# Altium project Rear_Controller.PrjPcb (part 1 of 2)
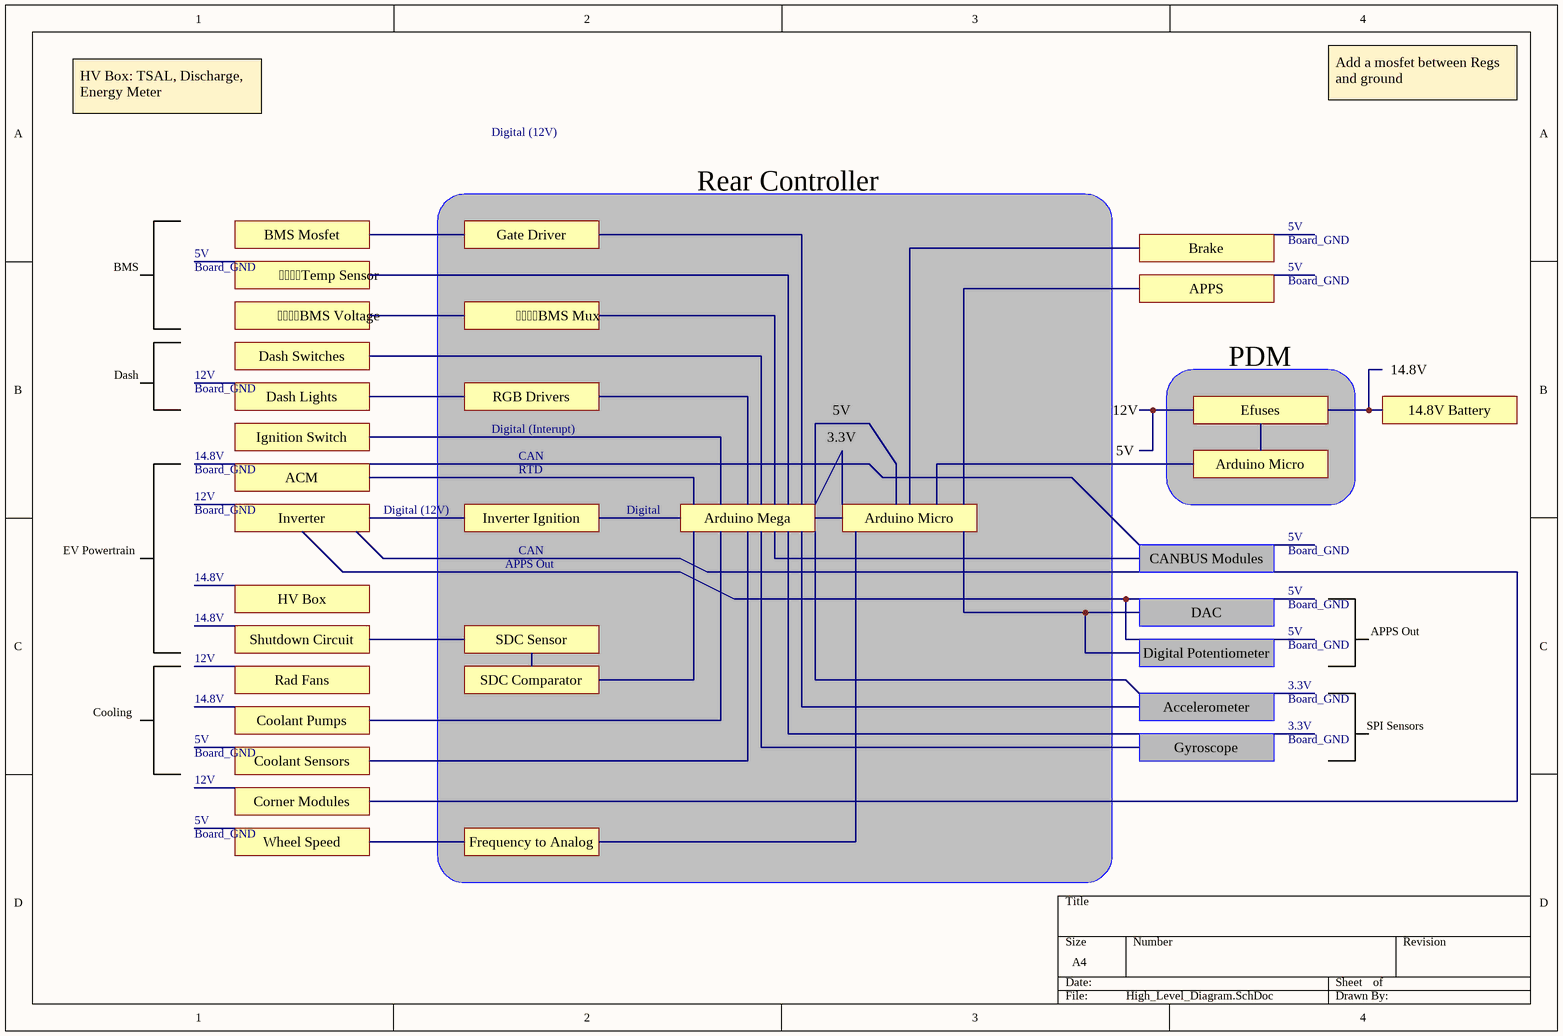
[diagram p0: High_Level_Diagram.SchDoc]
11 sheets, 140 parts. Net scope: flat (ports and power ports of the same name join across sheets).
Board file: Rear_Controller.PcbDoc
Sheets:
  High_Level_Diagram.SchDoc
  Arduino_Shields.SchDoc
  Passive_Circuits.SchDoc
  Frequency_Analog.SchDoc
  SPI_Breakout.SchDoc
  Connector.SchDoc
  PWM_Pump_Led.SchDoc
  Power_Relay.SchDoc
  Shutdown_Circuit.SchDoc
  Power_Distribution.SchDoc
  BMS.SchDoc

## Sheet High_Level_Diagram.SchDoc
size A4; SheetNumber: 1; SheetTotal: 11

### Notes on the sheet
- HV Box: TSAL, Discharge, Energy Meter
- Add a mosfet between Regs and ground
- Digital (12V)
- Rear Controller
- BMS Mosfet
- Gate Driver
- Brake
- 5V
- Board_GND
- BMS
- BMS Voltage
- Temp Sensor
- BMS Mux
- APPS
- Dash
- 12V
- Dash Switches
- PDM
- 14.8V
- Ignition Switch
- Dash Lights
- Digital (Interupt)
- RGB Drivers
- 3.3V
- Efuses
- 14.8V Battery
- Inverter
- ACM
- RTD
- CAN
- Inverter Ignition
- Digital
- Arduino Mega
- Arduino Micro
- EV Powertrain
- APPS Out
- CANBUS Modules
- Shutdown Circuit
- HV Box
- SDC Sensor
- Digital Potentiometer
- DAC
- Cooling
- Coolant Pumps
- Rad Fans
- SDC Comparator
- Accelerometer
- Coolant Sensors
- Gyroscope
- SPI Sensors
- Corner Modules
- Wheel Speed
- Frequency to Analog

## Sheet Arduino_Shields.SchDoc
size A4; SheetNumber: 2; SheetTotal: 11
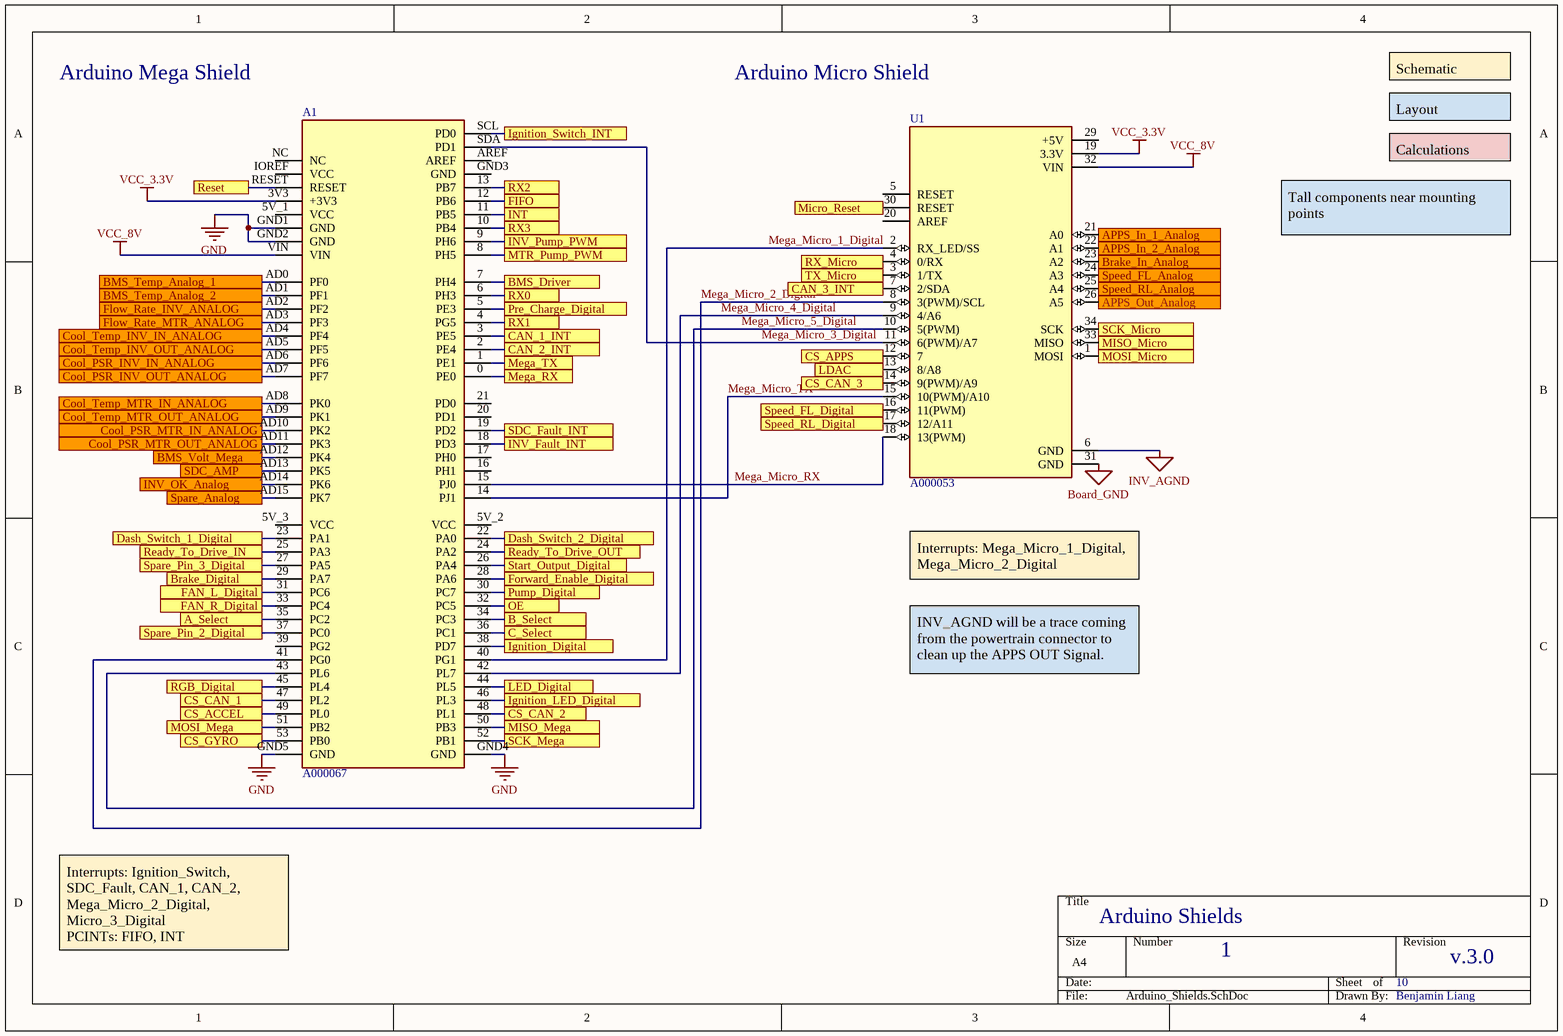
[diagram p1: Arduino_Shields.SchDoc]

### Parts
A1  A000067  [ARDUINO_A000067]
U1  A000053  [ARDUINO_A000053]

### Ports
A_Select, APPS_In_1_Analog, APPS_In_2_Analog, APPS_Out_Analog, B_Select, BMS_Driver, BMS_Temp_Analog_1, BMS_Temp_Analog_2, BMS_Volt_Mega, Brake_Digital, Brake_In_Analog, C_Select, CAN_1_INT, CAN_2_INT, CAN_3_INT, Cool_PSR_INV_IN_ANALOG, Cool_PSR_INV_OUT_ANALOG, Cool_PSR_MTR_IN_ANALOG, Cool_PSR_MTR_OUT_ANALOG, Cool_Temp_INV_IN_ANALOG, Cool_Temp_INV_OUT_ANALOG, Cool_Temp_MTR_IN_ANALOG, Cool_Temp_MTR_OUT_ANALOG, CS_ACCEL, CS_APPS, CS_CAN_1, CS_CAN_2, CS_CAN_3, CS_GYRO, Dash_Switch_1_Digital, Dash_Switch_2_Digital, FAN_L_Digital, FAN_R_Digital, FIFO, Flow_Rate_INV_ANALOG, Flow_Rate_MTR_ANALOG, Forward_Enable_Digital, Ignition_Digital, Ignition_LED_Digital, Ignition_Switch_INT, INT, INV_Fault_INT, INV_OK_Analog, INV_Pump_PWM, LDAC, LED_Digital, Mega_RX, Mega_TX, Micro_Reset, MISO_Mega, MISO_Micro, MOSI_Mega, MOSI_Micro, MTR_Pump_PWM, OE, Pre_Charge_Digital, Pump_Digital, Ready_To_Drive_IN, Ready_To_Drive_OUT, Reset, RGB_Digital, RX0, RX1, RX2, RX3, RX_Micro, SCK_Mega, SCK_Micro, SDC_AMP, SDC_Fault_INT, Spare_Analog, Spare_Pin_2_Digital, Spare_Pin_3_Digital, Speed_FL_Analog, Speed_FL_Digital, Speed_RL_Analog, Speed_RL_Digital, Start_Output_Digital, TX_Micro

### Nets
Board_GND: U1.31(GND)
GND: A1.GND1(GND) A1.GND2(GND) A1.GND4(GND) A1.GND5(GND)
INV_AGND: U1.6(GND)
VCC_3.3V: A1.3V3(+3V3) U1.19(3.3V)
VCC_8V: A1.VIN U1.32(VIN)
A_Select: A1.35(PC2) ; port A_Select
APPS_In_1_Analog: U1.21(A0) ; port APPS_In_1_Analog
APPS_In_2_Analog: U1.22(A1) ; port APPS_In_2_Analog
APPS_Out_Analog: U1.26(A5) ; port APPS_Out_Analog
B_Select: A1.34(PC3) ; port B_Select
BMS_Driver: A1.7(PH4) ; port BMS_Driver
BMS_Temp_Analog_1: A1.AD0(PF0) ; port BMS_Temp_Analog_1
BMS_Temp_Analog_2: A1.AD1(PF1) ; port BMS_Temp_Analog_2
BMS_Volt_Mega: A1.AD12(PK4) ; port BMS_Volt_Mega
Brake_Digital: A1.29(PA7) ; port Brake_Digital
Brake_In_Analog: U1.23(A2) ; port Brake_In_Analog
C_Select: A1.36(PC1) ; port C_Select
CAN_1_INT: A1.3(PE5) ; port CAN_1_INT
CAN_2_INT: A1.2(PE4) ; port CAN_2_INT
CAN_3_INT: U1.7(2/SDA) ; port CAN_3_INT
Cool_PSR_INV_IN_ANALOG: A1.AD6(PF6) ; port Cool_PSR_INV_IN_ANALOG
Cool_PSR_INV_OUT_ANALOG: A1.AD7(PF7) ; port Cool_PSR_INV_OUT_ANALOG
Cool_PSR_MTR_IN_ANALOG: A1.AD10(PK2) ; port Cool_PSR_MTR_IN_ANALOG
Cool_PSR_MTR_OUT_ANALOG: A1.AD11(PK3) ; port Cool_PSR_MTR_OUT_ANALOG
Cool_Temp_INV_IN_ANALOG: A1.AD4(PF4) ; port Cool_Temp_INV_IN_ANALOG
Cool_Temp_INV_OUT_ANALOG: A1.AD5(PF5) ; port Cool_Temp_INV_OUT_ANALOG
Cool_Temp_MTR_IN_ANALOG: A1.AD8(PK0) ; port Cool_Temp_MTR_IN_ANALOG
Cool_Temp_MTR_OUT_ANALOG: A1.AD9(PK1) ; port Cool_Temp_MTR_OUT_ANALOG
CS_ACCEL: A1.49(PL0) ; port CS_ACCEL
CS_APPS: U1.12(7) ; port CS_APPS
CS_CAN_1: A1.47(PL2) ; port CS_CAN_1
CS_CAN_2: A1.48(PL1) ; port CS_CAN_2
CS_CAN_3: U1.14(9(PWM)/A9) ; port CS_CAN_3
CS_GYRO: A1.53(PB0) ; port CS_GYRO
Dash_Switch_1_Digital: A1.23(PA1) ; port Dash_Switch_1_Digital
Dash_Switch_2_Digital: A1.22(PA0) ; port Dash_Switch_2_Digital
FAN_L_Digital: A1.31(PC6) ; port FAN_L_Digital
FAN_R_Digital: A1.33(PC4) ; port FAN_R_Digital
FIFO: A1.12(PB6) ; port FIFO
Flow_Rate_INV_ANALOG: A1.AD2(PF2) ; port Flow_Rate_INV_ANALOG
Flow_Rate_MTR_ANALOG: A1.AD3(PF3) ; port Flow_Rate_MTR_ANALOG
Forward_Enable_Digital: A1.28(PA6) ; port Forward_Enable_Digital
Ignition_Digital: A1.38(PD7) ; port Ignition_Digital
Ignition_LED_Digital: A1.46(PL3) ; port Ignition_LED_Digital
Ignition_Switch_INT: A1.SCL(PD0) ; port Ignition_Switch_INT
INT: A1.11(PB5) ; port INT
INV_Fault_INT: A1.18(PD3) ; port INV_Fault_INT
INV_OK_Analog: A1.AD14(PK6) ; port INV_OK_Analog
INV_Pump_PWM: A1.9(PH6) ; port INV_Pump_PWM
LDAC: U1.13(8/A8) ; port LDAC
LED_Digital: A1.44(PL5) ; port LED_Digital
Mega_Micro_1_Digital: A1.40(PG1) U1.2(RX_LED/SS)
Mega_Micro_2_Digital: A1.41(PG0) U1.8(3(PWM)/SCL)
Mega_Micro_3_Digital: A1.SDA(PD1) U1.11(6(PWM)/A7)
Mega_Micro_4_Digital: A1.42(PL7) U1.9(4/A6)
Mega_Micro_5_Digital: A1.43(PL6) U1.10(5(PWM))
Mega_Micro_RX: A1.15(PJ0) U1.18(13(PWM))
Mega_Micro_TX: A1.14(PJ1) U1.15(10(PWM)/A10)
Mega_RX: A1.0(PE0) ; port Mega_RX
Mega_TX: A1.1(PE1) ; port Mega_TX
Micro_Reset: U1.30(RESET) ; port Micro_Reset
MISO_Mega: A1.50(PB3) ; port MISO_Mega
MISO_Micro: U1.33(MISO) ; port MISO_Micro
MOSI_Mega: A1.51(PB2) ; port MOSI_Mega
MOSI_Micro: U1.1(MOSI) ; port MOSI_Micro
MTR_Pump_PWM: A1.8(PH5) ; port MTR_Pump_PWM
OE: A1.32(PC5) ; port OE
Pre_Charge_Digital: A1.5(PE3) ; port Pre_Charge_Digital
Pump_Digital: A1.30(PC7) ; port Pump_Digital
Ready_To_Drive_IN: A1.25(PA3) ; port Ready_To_Drive_IN
Ready_To_Drive_OUT: A1.24(PA2) ; port Ready_To_Drive_OUT
Reset: A1.RESET ; port Reset
RGB_Digital: A1.45(PL4) ; port RGB_Digital
RX0: A1.6(PH3) ; port RX0
RX1: A1.4(PG5) ; port RX1
RX2: A1.13(PB7) ; port RX2
RX3: A1.10(PB4) ; port RX3
RX_Micro: U1.4(0/RX) ; port RX_Micro
SCK_Mega: A1.52(PB1) ; port SCK_Mega
SCK_Micro: U1.34(SCK) ; port SCK_Micro
SDC_AMP: A1.AD13(PK5) ; port SDC_AMP
SDC_Fault_INT: A1.19(PD2) ; port SDC_Fault_INT
Spare_Analog: A1.AD15(PK7) ; port Spare_Analog
Spare_Pin_2_Digital: A1.37(PC0) ; port Spare_Pin_2_Digital
Spare_Pin_3_Digital: A1.27(PA5) ; port Spare_Pin_3_Digital
Speed_FL_Analog: U1.24(A3) ; port Speed_FL_Analog
Speed_FL_Digital: U1.16(11(PWM)) ; port Speed_FL_Digital
Speed_RL_Analog: U1.25(A4) ; port Speed_RL_Analog
Speed_RL_Digital: U1.17(12/A11) ; port Speed_RL_Digital
Start_Output_Digital: A1.26(PA4) ; port Start_Output_Digital
TX_Micro: U1.3(1/TX) ; port TX_Micro

Not connected (* = marked no-connect by the designer): A1 5V_1(VCC) 5V_2(VCC) 5V_3(VCC) 16(PH1) 17(PH0) 20(PD1) 21(PD0) 39(PG2) AREF GND3(GND) IOREF(VCC) NC; U1 5(RESET) 20(AREF) 29(+5V)

### Notes on the sheet
- Arduino Mega Shield
- Arduino Micro Shield
- Schematic
- Layout
- Calculations
- Tall components near mounting points
- Interrupts: Mega_Micro_1_Digital, Mega_Micro_2_Digital
- INV_AGND will be a trace coming from the powertrain connector to clean up the APPS OUT Signal.
- Arduino Shields
- Interrupts: Ignition_Switch, SDC_Fault, CAN_1, CAN_2, Mega_Micro_2_Digital, Micro_3_Digital                                PCINTs: FIFO, INT
- 1
- 10
- v.3.0
- Benjamin Liang

### Library data of the parts
A1 = A000067: ATmega2560 Arduino Mega2560 AVRÂ® ATmega AVR MCU 8-Bit Embedded Evaluation Board; Availability: Unavailable; Package: None; SnapEDA_Link: https://www.snapeda.com/parts/A000067/Arduino/view-part/557398/?ref=snap; MP: A000067; Price: None; Value: *; MF: Arduino
U1 = A000053: ATmega32U4 Arduino Micro AVRÂ® ATmega AVR MCU 8-Bit Embedded Evaluation Board; MP: A000053; SnapEDA_Link: https://www.snapeda.com/parts/A000053/Arduino/view-part/50900/?ref=snap; Digi-Key_Part_Number: 1050-1066-ND; MF: Arduino; Digi-Key_Purchase_URL: https://www.digikey.com/product-detail/en/arduino/A000053/1050-1066-ND/4486332?utm_source=snapeda&utm_medium=aggregator&utm_campaign=symbol; Package: None; Value: *

## Sheet Passive_Circuits.SchDoc
size A4; SheetNumber: 3; SheetTotal: 11
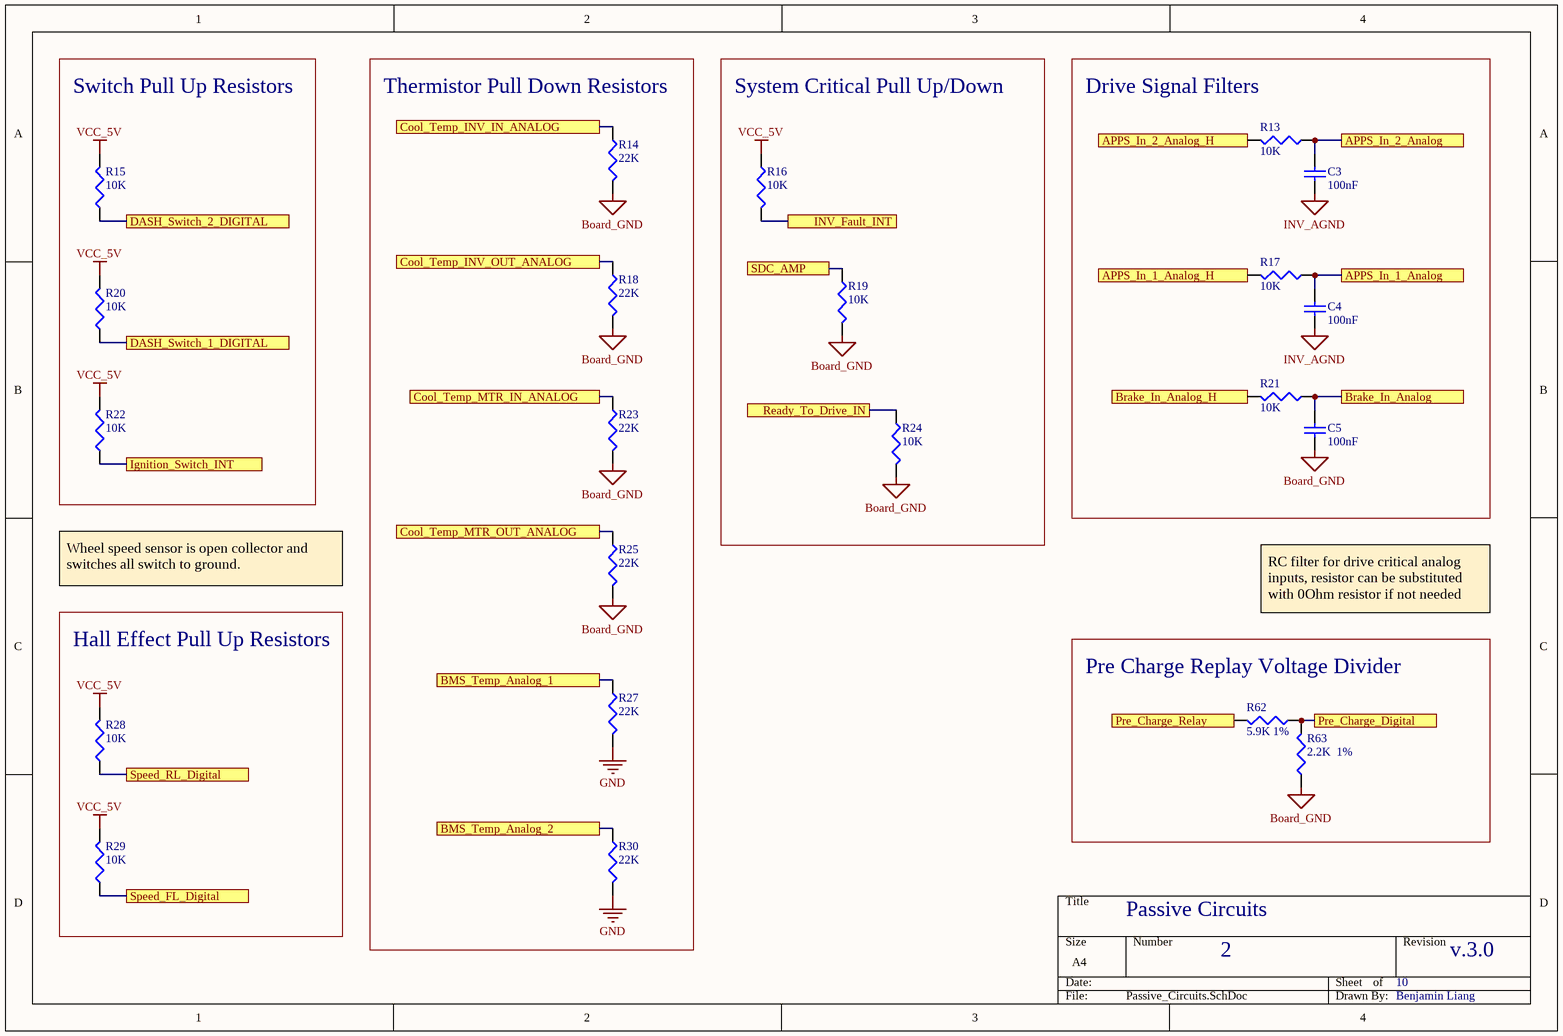
[diagram p2: Passive_Circuits.SchDoc]

### Parts
C3  100nF  [C1206]
C4  100nF  [C1206]
C5  100nF  [C1206]
R13  10K  [J1-0603]
R14  22K  [J1-0603]
R15  10K  [J1-0603]
R16  10K  [J1-0603]
R17  10K  [J1-0603]
R18  22K  [J1-0603]
R19  10K  [J1-0603]
R20  10K  [J1-0603]
R21  10K  [J1-0603]
R22  10K  [J1-0603]
R23  22K  [J1-0603]
R24  10K  [J1-0603]
R25  22K  [J1-0603]
R27  22K  [J1-0603]
R28  10K  [J1-0603]
R29  10K  [J1-0603]
R30  22K  [J1-0603]
R62  5.9K 1%  [J1-0603]
R63  2.2K  1%  [J1-0603]

### Blocks framed on the sheet
Switch Pull Up Resistors: R15 R20 R22
Thermistor Pull Down Resistors: R14 R18 R23 R25 R27 R30
System Critical Pull Up/Down: R16 R19 R24
Drive Signal Filters: C3-C5 R13 R17 R21
Hall Effect Pull Up Resistors: R28 R29
Pre Charge Replay Voltage Divider: R62 R63

### Ports
APPS_In_1_Analog, APPS_In_1_Analog_H, APPS_In_2_Analog, APPS_In_2_Analog_H, BMS_Temp_Analog_1, BMS_Temp_Analog_2, Brake_In_Analog, Brake_In_Analog_H, Cool_Temp_INV_IN_ANALOG, Cool_Temp_INV_OUT_ANALOG, Cool_Temp_MTR_IN_ANALOG, Cool_Temp_MTR_OUT_ANALOG, DASH_Switch_1_DIGITAL, DASH_Switch_2_DIGITAL, Ignition_Switch_INT, INV_Fault_INT, Pre_Charge_Digital, Pre_Charge_Relay, Ready_To_Drive_IN, SDC_AMP, Speed_FL_Digital, Speed_RL_Digital

### Nets
Board_GND: C5.2 R14.2 R18.2 R19.2 R23.2 R24.1 R25.2 R63.1
GND: R27.2 R30.2
INV_AGND: C3.2 C4.2
VCC_5V: R15.2 R16.1 R20.2 R22.2 R28.2 R29.2
APPS_In_1_Analog: C4.1 R17.1 ; port APPS_In_1_Analog
APPS_In_1_Analog_H: R17.2 ; port APPS_In_1_Analog_H
APPS_In_2_Analog: C3.1 R13.1 ; port APPS_In_2_Analog
APPS_In_2_Analog_H: R13.2 ; port APPS_In_2_Analog_H
BMS_Temp_Analog_1: R27.1 ; port BMS_Temp_Analog_1
BMS_Temp_Analog_2: R30.1 ; port BMS_Temp_Analog_2
Brake_In_Analog: C5.1 R21.1 ; port Brake_In_Analog
Brake_In_Analog_H: R21.2 ; port Brake_In_Analog_H
Cool_Temp_INV_IN_ANALOG: R14.1 ; port Cool_Temp_INV_IN_ANALOG
Cool_Temp_INV_OUT_ANALOG: R18.1 ; port Cool_Temp_INV_OUT_ANALOG
Cool_Temp_MTR_IN_ANALOG: R23.1 ; port Cool_Temp_MTR_IN_ANALOG
Cool_Temp_MTR_OUT_ANALOG: R25.1 ; port Cool_Temp_MTR_OUT_ANALOG
Dash_Switch_1_Digital: R20.1 ; port DASH_Switch_1_DIGITAL
Dash_Switch_2_Digital: R15.1 ; port DASH_Switch_2_DIGITAL
Ignition_Switch_INT: R22.1 ; port Ignition_Switch_INT
INV_Fault_INT: R16.2 ; port INV_Fault_INT
Pre_Charge_Digital: R62.1 R63.2 ; port Pre_Charge_Digital
Pre_Charge_Relay: R62.2 ; port Pre_Charge_Relay
Ready_To_Drive_IN: R24.2 ; port Ready_To_Drive_IN
SDC_AMP: R19.1 ; port SDC_AMP
Speed_FL_Digital: R29.1 ; port Speed_FL_Digital
Speed_RL_Digital: R28.1 ; port Speed_RL_Digital

### Notes on the sheet
- Wheel speed sensor is open collector and switches all switch to ground.
- RC filter for drive critical analog inputs, resistor can be substituted with 0Ohm resistor if not needed
- Passive Circuits
- 2
- 10
- v.3.0
- Benjamin Liang

### Library data of the parts
C3-C5 = Cap Semi: Capacitor (Semiconductor SIM Model); Published: 8-Jun-2000; LatestRevisionDate: 29-May-2009; LatestRevisionNote: IPC-7351 Footprint Added.; PackageReference: C1206; Publisher: Altium Limited; PackageDescription: Chip Capacitor; Value: 100nF
R13 R17 R21 = Res3: Resistor; Published: 8-Jun-2000; LatestRevisionDate: 29-May-2009; LatestRevisionNote: IPC-7351 Footprint Added.; PackageReference: J1-0603; Publisher: Altium Limited; PackageDescription: Chip Resistor; Value: 10K
R14-R16 R18-R20 R22-R25 R27-R30 R62 R63 = Res3: Resistor; Value: 220; Published: 8-Jun-2000; LatestRevisionDate: 29-May-2009; LatestRevisionNote: IPC-7351 Footprint Added.; PackageReference: J1-0603; Publisher: Altium Limited; PackageDescription: Chip Resistor

## Sheet Frequency_Analog.SchDoc
size A4; SheetNumber: 4; SheetTotal: 11
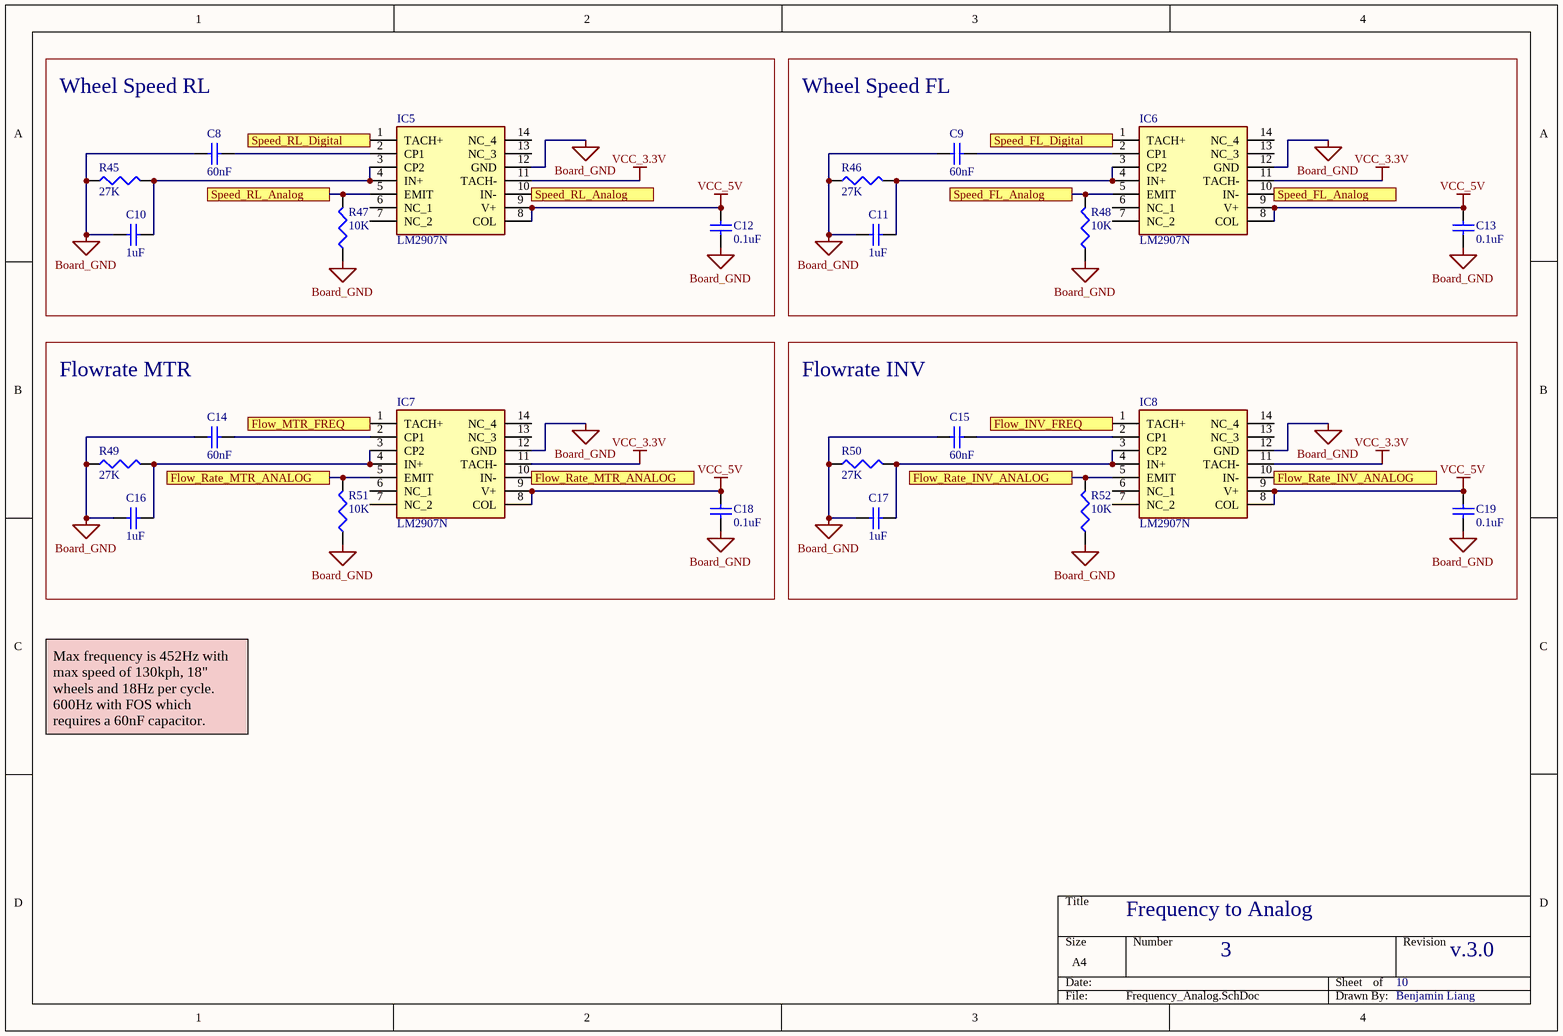
[diagram p3: Frequency_Analog.SchDoc]

### Parts
C8  60nF  [C1206]
C9  60nF  [C1206]
C10  1uF  [C1206]
C11  1uF  [C1206]
C12  0.1uF  [C1206]
C13  0.1uF  [C1206]
C14  60nF  [C1206]
C15  60nF  [C1206]
C16  1uF  [C1206]
C17  1uF  [C1206]
C18  0.1uF  [C1206]
C19  0.1uF  [C1206]
IC5  LM2907N  [DIP825W45P254L1905H9015Q14]
IC6  LM2907N  [DIP825W45P254L1905H9015Q14]
IC7  LM2907N  [DIP825W45P254L1905H9015Q14]
IC8  LM2907N  [DIP825W45P254L1905H9015Q14]
R45  27K  [J1-0603]
R46  27K  [J1-0603]
R47  10K  [J1-0603]
R48  10K  [J1-0603]
R49  27K  [J1-0603]
R50  27K  [J1-0603]
R51  10K  [J1-0603]
R52  10K  [J1-0603]

### Blocks framed on the sheet
Wheel Speed RL: C8 C10 C12 IC5 R45 R47
Wheel Speed FL: C9 C11 C13 IC6 R46 R48
Flowrate MTR: C14 C16 C18 IC7 R49 R51
Flowrate INV: C15 C17 C19 IC8 R50 R52

### Ports
Flow_INV_FREQ, Flow_MTR_FREQ, Flow_Rate_INV_ANALOG, Flow_Rate_MTR_ANALOG, Speed_FL_Analog, Speed_FL_Digital, Speed_RL_Analog, Speed_RL_Digital

### Nets
Board_GND: C8.2 C9.2 C10.2 C11.2 C12.2 C13.2 C14.2 C15.2 C16.2 C17.2 C18.2 C19.2 IC5.12(GND) IC6.12(GND) IC7.12(GND) IC8.12(GND) R45.1 R46.1 R47.1 R48.1 R49.1 R50.1 R51.1 R52.1
VCC_3.3V: IC5.11(TACH-) IC6.11(TACH-) IC7.11(TACH-) IC8.11(TACH-)
VCC_5V: C12.1 C13.1 C18.1 C19.1 IC5.8(COL) IC5.9(V+) IC6.8(COL) IC6.9(V+) IC7.8(COL) IC7.9(V+) IC8.8(COL) IC8.9(V+)
Flow_INV_FREQ: IC8.1(TACH+) ; port Flow_INV_FREQ
Flow_MTR_FREQ: IC7.1(TACH+) ; port Flow_MTR_FREQ
Flow_Rate_INV_ANALOG: IC8.5(EMIT) IC8.10(IN-) R52.2 ; port Flow_Rate_INV_ANALOG
Flow_Rate_MTR_ANALOG: IC7.5(EMIT) IC7.10(IN-) R51.2 ; port Flow_Rate_MTR_ANALOG
Speed_FL_Analog: IC6.5(EMIT) IC6.10(IN-) R48.2 ; port Speed_FL_Analog
Speed_FL_Digital: IC6.1(TACH+) ; port Speed_FL_Digital
Speed_RL_Analog: IC5.5(EMIT) IC5.10(IN-) R47.2 ; port Speed_RL_Analog
Speed_RL_Digital: IC5.1(TACH+) ; port Speed_RL_Digital
NetC8_1: C8.1 IC5.2(CP1)
NetC9_1: C9.1 IC6.2(CP1)
NetC10_1: C10.1 IC5.3(CP2) IC5.4(IN+) R45.2
NetC11_1: C11.1 IC6.3(CP2) IC6.4(IN+) R46.2
NetC14_1: C14.1 IC7.2(CP1)
NetC15_1: C15.1 IC8.2(CP1)
NetC16_1: C16.1 IC7.3(CP2) IC7.4(IN+) R49.2
NetC17_1: C17.1 IC8.3(CP2) IC8.4(IN+) R50.2

Not connected (* = marked no-connect by the designer): IC5 6(NC_1) 7(NC_2) 13(NC_3) 14(NC_4); IC6 6(NC_1) 7(NC_2) 13(NC_3) 14(NC_4); IC7 6(NC_1) 7(NC_2) 13(NC_3) 14(NC_4); IC8 6(NC_1) 7(NC_2) 13(NC_3) 14(NC_4)

### Notes on the sheet
- Max frequency is 452Hz with max speed of 130kph, 18" wheels and 18Hz per cycle. 600Hz with FOS which requires a 60nF capacitor.
- Frequency to Analog
- 3
- 10
- v.3.0
- Benjamin Liang

### Library data of the parts
C8-C19 = Cap Semi: Capacitor (Semiconductor SIM Model); Value: 100nF; Published: 8-Jun-2000; LatestRevisionDate: 29-May-2009; LatestRevisionNote: IPC-7351 Footprint Added.; PackageReference: C1206; Publisher: Altium Limited; PackageDescription: Chip Capacitor
IC5-IC8 = LM2907N: Integrated Circuit; Manufacturer_Name: Texas Instruments; Datasheet Link: https://www.ti.com/lit/ds/symlink/lm2907-n.pdf?ts=1629619091467&ref_url=https%253A%252F%252Fwww.google.com%252F; Height: 5.334mm; Manufacturer_Part_Number: LM2907N; Mouser Part Number: 926-LM2907N; Mouser Price/Stock: https://www.mouser.co.uk/ProductDetail/Texas-Instruments/LM2907N?qs=X1J7HmVL2ZGG77PtYOUT4A%3D%3D
R45 R46 R49 R50 = Res3: Resistor; Value: 10K; Published: 8-Jun-2000; LatestRevisionDate: 29-May-2009; LatestRevisionNote: IPC-7351 Footprint Added.; PackageReference: J1-0603; Publisher: Altium Limited; PackageDescription: Chip Resistor
R47 R48 R51 R52 = Res3: Resistor; Published: 8-Jun-2000; LatestRevisionDate: 29-May-2009; LatestRevisionNote: IPC-7351 Footprint Added.; PackageReference: J1-0603; Publisher: Altium Limited; PackageDescription: Chip Resistor; Value: 10K

## Sheet SPI_Breakout.SchDoc
size A4; SheetNumber: 5; SheetTotal: 11
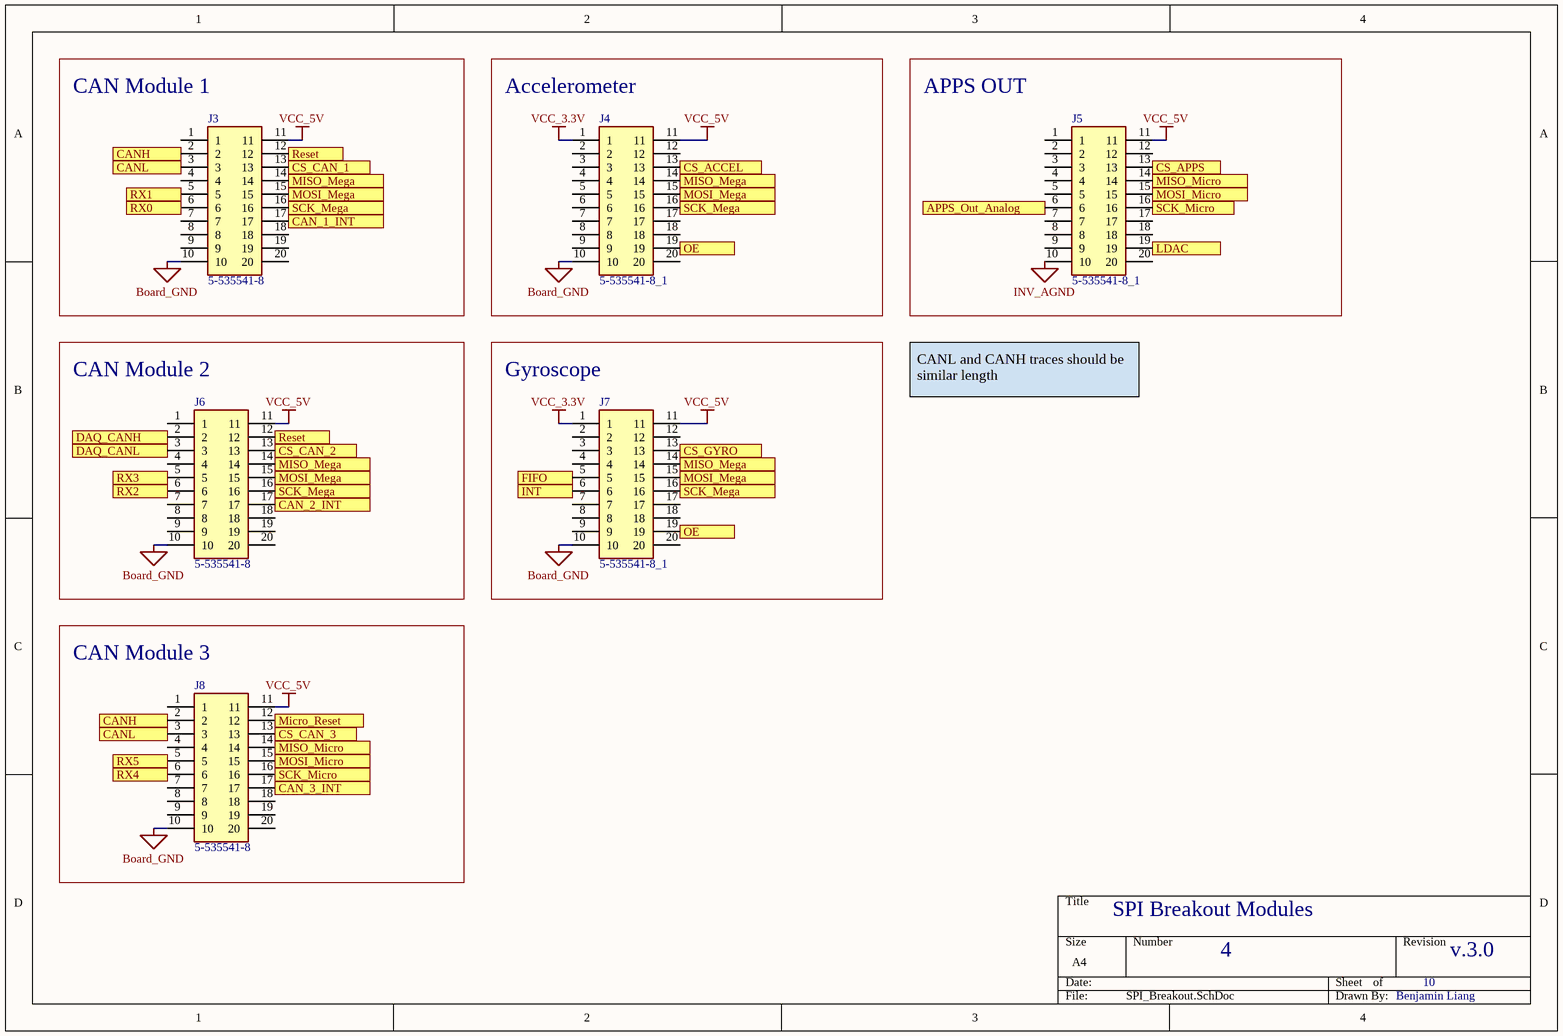
[diagram p4: SPI_Breakout.SchDoc]

### Parts
J3  5-535541-8  [RHDR10W76P0X254_1X10_2540X356X889P_1.3]
J4  5-535541-8_1  [RHDR10W76P0X254_1X10_2540X356X889P_0.6]
J5  5-535541-8_1  [RHDR10W76P0X254_1X10_2540X356X889P_0.6]
J6  5-535541-8  [RHDR10W76P0X254_1X10_2540X356X889P_1.3]
J7  5-535541-8_1  [RHDR10W76P0X254_1X10_2540X356X889P_0.6]
J8  5-535541-8  [RHDR10W76P0X254_1X10_2540X356X889P_1.3]

### Blocks framed on the sheet
CAN Module 1: J3
Accelerometer: J4
APPS OUT: J5
CAN Module 2: J6
Gyroscope: J7
CAN Module 3: J8

### Ports
APPS_Out_Analog, CAN_1_INT, CAN_2_INT, CAN_3_INT, CANH, CANL, CS_ACCEL, CS_APPS, CS_CAN_1, CS_CAN_2, CS_CAN_3, CS_GYRO, DAQ_CANH, DAQ_CANL, FIFO, INT, LDAC, Micro_Reset, MISO_Mega, MISO_Micro, MOSI_Mega, MOSI_Micro, OE, Reset, RX0, RX1, RX2, RX3, RX4, RX5, SCK_Mega, SCK_Micro

### Nets
Board_GND: J3.10 J4.10 J6.10 J7.10 J8.10
INV_AGND: J5.10
VCC_3.3V: J4.1 J7.1
VCC_5V: J3.11 J4.11 J5.11 J6.11 J7.11 J8.11
APPS_Out_Analog: J5.6 ; port APPS_Out_Analog
CAN_1_INT: J3.17 ; port CAN_1_INT
CAN_2_INT: J6.17 ; port CAN_2_INT
CAN_3_INT: J8.17 ; port CAN_3_INT
CANH: J3.2 J8.2 ; port CANH
CANL: J3.3 J8.3 ; port CANL
CS_ACCEL: J4.13 ; port CS_ACCEL
CS_APPS: J5.13 ; port CS_APPS
CS_CAN_1: J3.13 ; port CS_CAN_1
CS_CAN_2: J6.13 ; port CS_CAN_2
CS_CAN_3: J8.13 ; port CS_CAN_3
CS_GYRO: J7.13 ; port CS_GYRO
DAQ_CANH: J6.2 ; port DAQ_CANH
DAQ_CANL: J6.3 ; port DAQ_CANL
FIFO: J7.5 ; port FIFO
INT: J7.6 ; port INT
LDAC: J5.19 ; port LDAC
Micro_Reset: J8.12 ; port Micro_Reset
MISO_Mega: J3.14 J4.14 J6.14 J7.14 ; port MISO_Mega
MISO_Micro: J5.14 J8.14 ; port MISO_Micro
MOSI_Mega: J3.15 J4.15 J6.15 J7.15 ; port MOSI_Mega
MOSI_Micro: J5.15 J8.15 ; port MOSI_Micro
OE: J4.19 J7.19 ; port OE
Reset: J3.12 J6.12 ; port Reset
RX0: J3.6 ; port RX0
RX1: J3.5 ; port RX1
RX2: J6.6 ; port RX2
RX3: J6.5 ; port RX3
RX4: J8.6 ; port RX4
RX5: J8.5 ; port RX5
SCK_Mega: J3.16 J4.16 J6.16 J7.16 ; port SCK_Mega
SCK_Micro: J5.16 J8.16 ; port SCK_Micro

Not connected (* = marked no-connect by the designer): J3 1 4 7 8 9 18 19 20; J4 2 3 4 5 6 7 8 9 12 17 18 20; J5 1 2 3 4 5 7 8 9 12 17 18 20; J6 1 4 7 8 9 18 19 20; J7 2 3 4 7 8 9 12 17 18 20; J8 1 4 7 8 9 18 19 20

### Notes on the sheet
- CANL and CANH traces should be similar length
- SPI Breakout Modules
- 4
- 10
- v.3.0
- Benjamin Liang

### Library data of the parts
J3 J6 J8 = 5-535541-8: Connector; Manufacturer_Name: TE Connectivity; Datasheet Link: http://catalog.tycoelectronics.com/TE/bin/TE.Connect?C=1&PN=5-535541-8&M=BYPN&LG=1&I=13&button.x=43&button.y=16; Height: 8.89mm; Manufacturer_Part_Number: 5-535541-8; Mouser Part Number: 571-5-535541-8; Mouser Price/Stock: https://www.mouser.co.uk/ProductDetail/TE-Connectivity/5-535541-8?qs=xDp7PGUNC%252Bt0eA%2FEm7ovMw%3D%3D; Arrow Part Number: 5-535541-8; Arrow Price/Stock: https://www.arrow.com/en/products/5-535541-8/te-connectivity
J4 J5 J7 = 5-535541-8_1: Connector; Manufacturer_Name: TE Connectivity; Datasheet Link: http://catalog.tycoelectronics.com/TE/bin/TE.Connect?C=1&PN=5-535541-8&M=BYPN&LG=1&I=13&button.x=43&button.y=16; Height: 8.89mm; Manufacturer_Part_Number: 5-535541-8; Mouser Part Number: 571-5-535541-8; Mouser Price/Stock: https://www.mouser.co.uk/ProductDetail/TE-Connectivity/5-535541-8?qs=xDp7PGUNC%252Bt0eA%2FEm7ovMw%3D%3D; Arrow Part Number: 5-535541-8; Arrow Price/Stock: https://www.arrow.com/en/products/5-535541-8/te-connectivity

## Sheet Connector.SchDoc
size A4; SheetNumber: 6; SheetTotal: 11
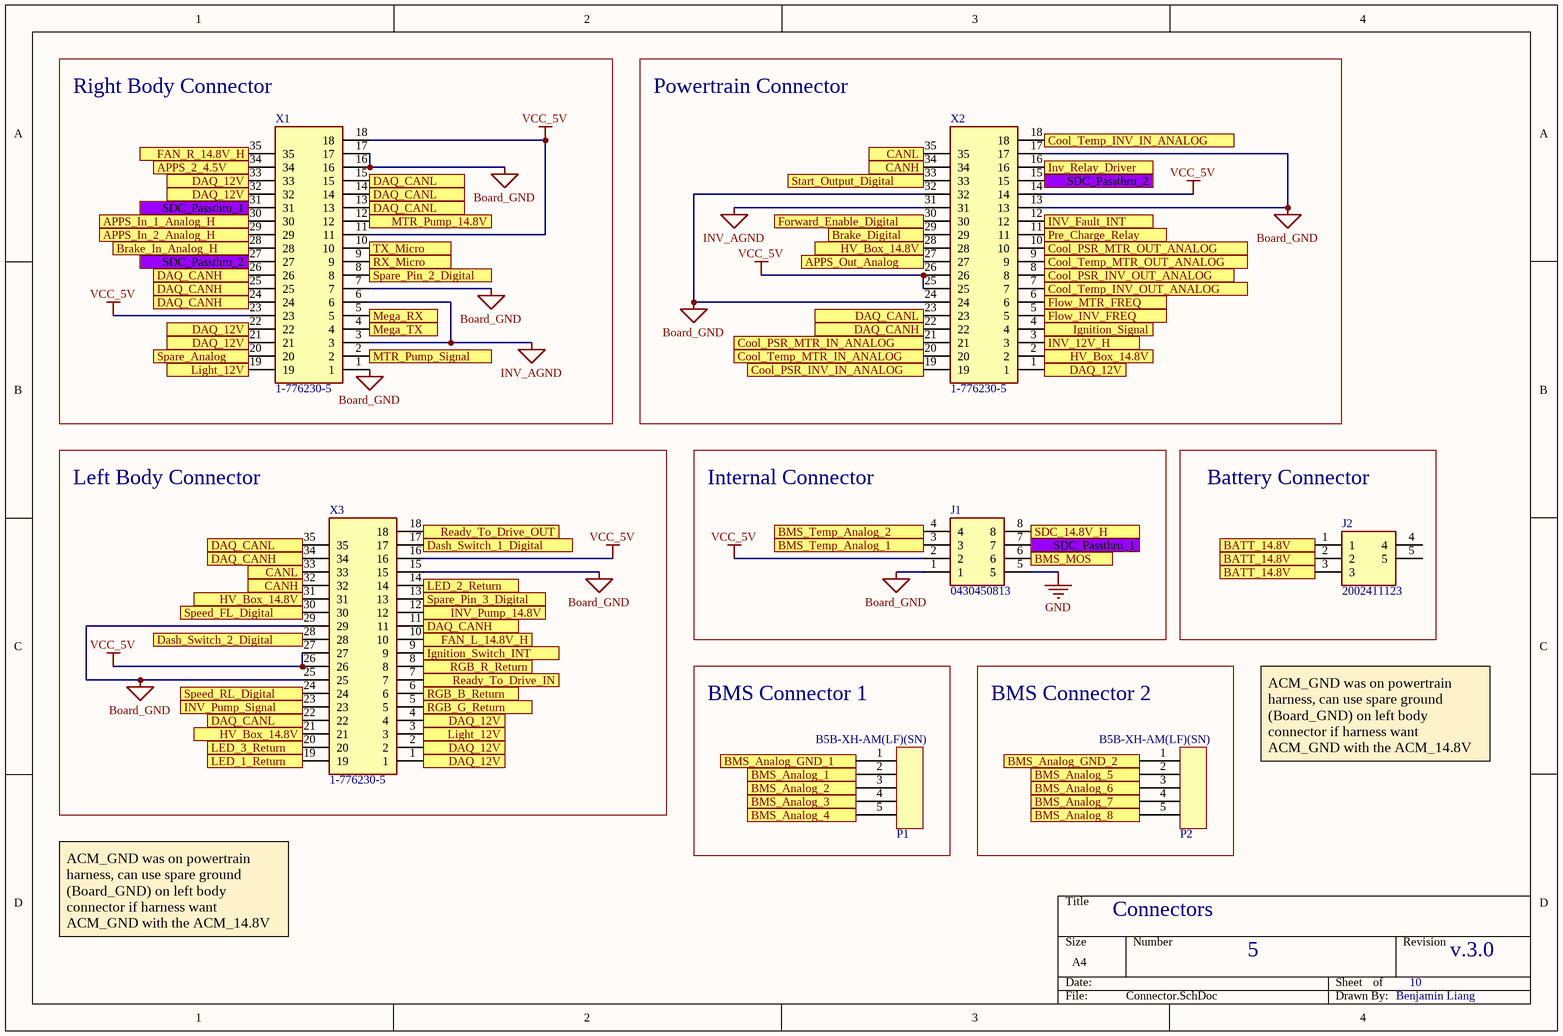
[diagram p5: Connector.SchDoc]

### Parts
J1  0430450813  [0430450813]
J2  2002411123  [2002411YY3_11/12/13]
P1  B5B-XH-AM(LF)(SN)  [B5B-XH-AM(LF)(SN)]  (value not drawn)
P2  B5B-XH-AM(LF)(SN)  [B5B-XH-AM(LF)(SN)]  (value not drawn)
X1  1-776230-5  [17762305]
X2  1-776230-5  [17762305]
X3  1-776230-5  [17762305]

### Blocks framed on the sheet
Right Body Connector: X1
Powertrain Connector: X2
Left Body Connector: X3
Internal Connector: J1
Battery Connector: J2
BMS Connector 1: P1
BMS Connector 2: P2

### Ports
APPS_2_4.5V, APPS_In_1_Analog_H, APPS_In_2_Analog_H, APPS_Out_Analog, BATT_14.8V, BMS_Analog_1, BMS_Analog_2, BMS_Analog_3, BMS_Analog_4, BMS_Analog_5, BMS_Analog_6, BMS_Analog_7, BMS_Analog_8, BMS_Analog_GND_1, BMS_Analog_GND_2, BMS_MOS, BMS_Temp_Analog_1, BMS_Temp_Analog_2, Brake_Digital, Brake_In_Analog_H, CANH, CANL, Cool_PSR_INV_IN_ANALOG, Cool_PSR_INV_OUT_ANALOG, Cool_PSR_MTR_IN_ANALOG, Cool_PSR_MTR_OUT_ANALOG, Cool_Temp_INV_IN_ANALOG, Cool_Temp_INV_OUT_ANALOG, Cool_Temp_MTR_IN_ANALOG, Cool_Temp_MTR_OUT_ANALOG, DAQ_12V, DAQ_CANH, DAQ_CANL, Dash_Switch_1_Digital, Dash_Switch_2_Digital, FAN_L_14.8V_H, FAN_R_14.8V_H, Flow_INV_FREQ, Flow_MTR_FREQ, Forward_Enable_Digital, HV_Box_14.8V, Ignition_Signal, Ignition_Switch_INT, INV_12V_H, INV_Fault_INT, INV_Pump_14.8V, INV_Pump_Signal, Inv_Relay_Driver, LED_1_Return, LED_2_Return, LED_3_Return, Light_12V, Mega_RX, Mega_TX, MTR_Pump_14.8V, MTR_Pump_Signal, Pre_Charge_Relay, Ready_To_Drive_IN, Ready_To_Drive_OUT, RGB_B_Return, RGB_G_Return, RGB_R_Return, RX_Micro, SDC_14.8V_H, SDC_Passthru_1, SDC_Passthru_2, Spare_Analog, Spare_Pin_2_Digital, Spare_Pin_3_Digital, Speed_FL_Digital, Speed_RL_Digital, Start_Output_Digital, TX_Micro

### Nets
Board_GND: J1.1 X1.1 X1.7 X1.16 X1.17 X2.13 X2.17 X2.24 X2.32 X3.15 X3.25 X3.29
GND: J1.5
INV_AGND: X1.3 X1.6 X2.31
VCC_5V: J1.2 X1.11 X1.18 X1.23 X2.14 X2.25 X2.26 X3.16 X3.26 X3.27
APPS_2_4.5V: X1.34 ; port APPS_2_4.5V
APPS_In_1_Analog_H: X1.30 ; port APPS_In_1_Analog_H
APPS_In_2_Analog_H: X1.29 ; port APPS_In_2_Analog_H
APPS_Out_Analog: X2.27 ; port APPS_Out_Analog
BATT_14.8V: J2.1 J2.2 J2.3 ; port BATT_14.8V
BMS_Analog_1: P1.2 ; port BMS_Analog_1
BMS_Analog_2: P1.3 ; port BMS_Analog_2
BMS_Analog_3: P1.4 ; port BMS_Analog_3
BMS_Analog_4: P1.5 ; port BMS_Analog_4
BMS_Analog_5: P2.2 ; port BMS_Analog_5
BMS_Analog_6: P2.3 ; port BMS_Analog_6
BMS_Analog_7: P2.4 ; port BMS_Analog_7
BMS_Analog_8: P2.5 ; port BMS_Analog_8
BMS_Analog_GND_1: P1.1 ; port BMS_Analog_GND_1
BMS_Analog_GND_2: P2.1 ; port BMS_Analog_GND_2
BMS_MOS: J1.6 ; port BMS_MOS
BMS_Temp_Analog_1: J1.3 ; port BMS_Temp_Analog_1
BMS_Temp_Analog_2: J1.4 ; port BMS_Temp_Analog_2
Brake_Digital: X2.29 ; port Brake_Digital
Brake_In_Analog_H: X1.28 ; port Brake_In_Analog_H
CANH: X2.34 X3.32 ; port CANH
CANL: X2.35 X3.33 ; port CANL
Cool_PSR_INV_IN_ANALOG: X2.19 ; port Cool_PSR_INV_IN_ANALOG
Cool_PSR_INV_OUT_ANALOG: X2.8 ; port Cool_PSR_INV_OUT_ANALOG
Cool_PSR_MTR_IN_ANALOG: X2.21 ; port Cool_PSR_MTR_IN_ANALOG
Cool_PSR_MTR_OUT_ANALOG: X2.10 ; port Cool_PSR_MTR_OUT_ANALOG
Cool_Temp_INV_IN_ANALOG: X2.18 ; port Cool_Temp_INV_IN_ANALOG
Cool_Temp_INV_OUT_ANALOG: X2.7 ; port Cool_Temp_INV_OUT_ANALOG
Cool_Temp_MTR_IN_ANALOG: X2.20 ; port Cool_Temp_MTR_IN_ANALOG
Cool_Temp_MTR_OUT_ANALOG: X2.9 ; port Cool_Temp_MTR_OUT_ANALOG
DAQ_12V: X1.21 X1.22 X1.32 X1.33 X2.1 X3.1 X3.2 X3.4 ; port DAQ_12V
DAQ_CANH: X1.24 X1.25 X1.26 X2.22 X3.11 X3.34 ; port DAQ_CANH
DAQ_CANL: X1.13 X1.14 X1.15 X2.23 X3.22 X3.35 ; port DAQ_CANL
Dash_Switch_1_Digital: X3.17 ; port Dash_Switch_1_Digital
Dash_Switch_2_Digital: X3.28 ; port Dash_Switch_2_Digital
FAN_L_14.8V_H: X3.10 ; port FAN_L_14.8V_H
FAN_R_14.8V_H: X1.35 ; port FAN_R_14.8V_H
Flow_INV_FREQ: X2.5 ; port Flow_INV_FREQ
Flow_MTR_FREQ: X2.6 ; port Flow_MTR_FREQ
Forward_Enable_Digital: X2.30 ; port Forward_Enable_Digital
HV_Box_14.8V: X2.2 X2.28 X3.21 X3.31 ; port HV_Box_14.8V
Ignition_Signal: X2.4 ; port Ignition_Signal
Ignition_Switch_INT: X3.9 ; port Ignition_Switch_INT
INV_12V_H: X2.3 ; port INV_12V_H
INV_Fault_INT: X2.12 ; port INV_Fault_INT
INV_Pump_14.8V: X3.12 ; port INV_Pump_14.8V
INV_Pump_Signal: X3.23 ; port INV_Pump_Signal
Inv_Relay_Driver: X2.16 ; port Inv_Relay_Driver
LED_1_Return: X3.19 ; port LED_1_Return
LED_2_Return: X3.14 ; port LED_2_Return
LED_3_Return: X3.20 ; port LED_3_Return
Light_12V: X1.19 X3.3 ; port Light_12V
Mega_RX: X1.5 ; port Mega_RX
Mega_TX: X1.4 ; port Mega_TX
MTR_Pump_14.8V: X1.12 ; port MTR_Pump_14.8V
MTR_Pump_Signal: X1.2 ; port MTR_Pump_Signal
Pre_Charge_Relay: X2.11 ; port Pre_Charge_Relay
Ready_To_Drive_IN: X3.7 ; port Ready_To_Drive_IN
Ready_To_Drive_OUT: X3.18 ; port Ready_To_Drive_OUT
RGB_B_Return: X3.6 ; port RGB_B_Return
RGB_G_Return: X3.5 ; port RGB_G_Return
RGB_R_Return: X3.8 ; port RGB_R_Return
RX_Micro: X1.9 ; port RX_Micro
SDC_14.8V_H: J1.8 ; port SDC_14.8V_H
SDC_Passthru_1: J1.7 X1.31 ; port SDC_Passthru_1
SDC_Passthru_2: X1.27 X2.15 ; port SDC_Passthru_2
Spare_Analog: X1.20 ; port Spare_Analog
Spare_Pin_2_Digital: X1.8 ; port Spare_Pin_2_Digital
Spare_Pin_3_Digital: X3.13 ; port Spare_Pin_3_Digital
Speed_FL_Digital: X3.30 ; port Speed_FL_Digital
Speed_RL_Digital: X3.24 ; port Speed_RL_Digital
Start_Output_Digital: X2.33 ; port Start_Output_Digital
TX_Micro: X1.10 ; port TX_Micro

Not connected (* = marked no-connect by the designer): J2 4 5

### Notes on the sheet
- (near P1) B5B-XH-AM(LF)(SN)
- (near P2) B5B-XH-AM(LF)(SN)
- ACM_GND was on powertrain harness, can use spare ground (Board_GND) on left body connector if harness want ACM_GND with the ACM_14.8V
- Connectors
- 5
- 10
- v.3.0
- Benjamin Liang

### Library data of the parts
J1 = 0430450813: Connector; Manufacturer_Name: Molex; Datasheet Link: https://media.digikey.com/pdf/Data%20Sheets/Molex%20PDFs/PK-70873-05xx_1_N3.pdf; Height: 10.16mm; Manufacturer_Part_Number: 0430450813; Arrow Part Number: 0430450813; Arrow Price/Stock: https://www.arrow.com/en/products/0430450813/molex
J2 = 2002411123: Connector; Manufacturer_Name: Molex; Datasheet Link: https://www.molex.com/pdm_docs/sd/2002411113_sd.pdf; Height: 17.5mm; Manufacturer_Part_Number: 2002411123
P1 P2 = B5B-XH-AM(LF)(SN): JST, Connector Header, 5 Position, 2.5mm, Through Hole, Shrouded - 4 Wall, Press-Fit, Solder, Detent Lock, Natural; Contact Resistance: 20mR; Max Current Rating: 3A; Number of Positions: 5; Max Voltage Rating (AC): 250V; Connector Type: Male Pin; Pitch: 0.098inch; Supplier 1: Digi-Key; Manufacturer: JST; Manufacturer Part Number: B5B-XH-AM(LF)(SN); RoHS: Yes; Category: Connectors; Stock 1: 3220; Pricing 1: 1=0.26000, 10=0.21900, 100=0.16880, 500=0.14286, 1000=0.11688, 5000=0.10389, 10000=0.09415 (USD); Mount: Through Hole; Contact Material: Brass; Contact Plating: Tin,Copper,Lead; Color: Green; Housing Color: White; Housing Material: Polyamide; Min Operating Temperature: -25°C; Max Operating Temperature: 85°C; Number of Rows: 1; Packaging: Bulk; Termination: Press-Fit; Fastening Type: Detent; Orientation: Straight; Series: XH; Contact Type: Male Pin; Length: 14.9mm; Depth: 5.75mm; Lead Free: Lead Free; ComponentLink1URL: https://datasheet.ciiva.com/26894/getdatasheetpartid-640829-26894480.pdf?src-supplier=Verical; ComponentLink1Description: https://datasheet.ciiva.com/26894/getdatasheetpartid-640829-26894480.pdf?src-supplier=Verical; ComponentLink2URL: https://datasheet.ciiva.com/726/exh-726396.pdf?src-supplier=Digi-Key; ComponentLink2Description: https://datasheet.ciiva.com/726/exh-726396.pdf?src-supplier=Digi-Key
X1-X3 = 1-776230-5: Connector; Manufacturer_Name: TE Connectivity; Datasheet Link: https://www.te.com/commerce/DocumentDelivery/DDEController?Action=showdoc&DocId=Customer+Drawing%7F776230%7FA11%7Fpdf%7FEnglish%7FENG_CD_776230_A11.pdf%7F1-776230-5; Height: 34.25mm; Manufacturer_Part_Number: 1-776230-5; Mouser Part Number: 571-1-776230-5; Mouser Price/Stock: https://www.mouser.co.uk/ProductDetail/TE-Connectivity-AMP/1-776230-5?qs=YqNA2qefETCOX%252BF7Gna1xg%3D%3D

## Sheet PWM_Pump_Led.SchDoc
size A4; SheetNumber: 7; SheetTotal: 11
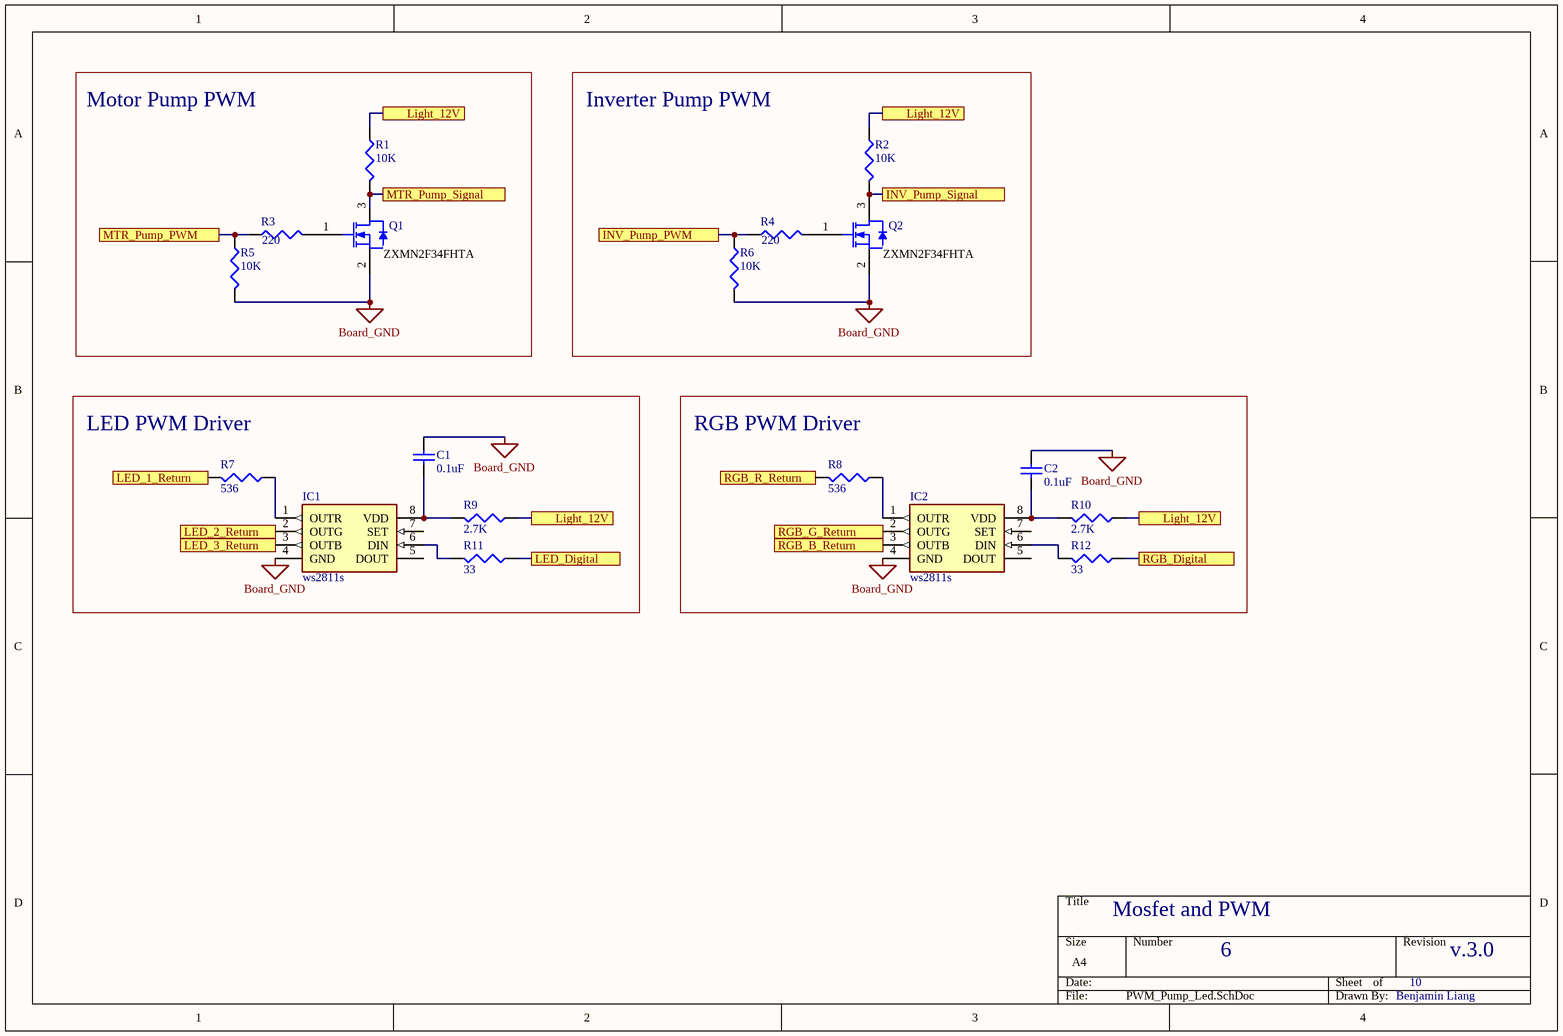
[diagram p6: PWM_Pump_Led.SchDoc]

### Parts
C1  0.1uF  [C1206]
C2  0.1uF  [C1206]
IC1  ws2811s  [SOIC127P600X175-8N]
IC2  ws2811s  [SOIC127P600X175-8N]
Q1  ZXMN2F34FHTA  [FAIR-SSOT3L-3_V]  (value not drawn)
Q2  ZXMN2F34FHTA  [FAIR-SSOT3L-3_V]  (value not drawn)
R1  10K  [J1-0603]
R2  10K  [J1-0603]
R3  220  [J1-0603]
R4  220  [J1-0603]
R5  10K  [J1-0603]
R6  10K  [J1-0603]
R7  536  [J1-0603]
R8  536  [J1-0603]
R9  2.7K  [J1-0603]
R10  2.7K  [J1-0603]
R11  33  [J1-0603]
R12  33  [J1-0603]

### Blocks framed on the sheet
Motor Pump PWM: Q1 R1 R3 R5
Inverter Pump PWM: Q2 R2 R4 R6
LED PWM Driver: C1 IC1 R7 R9 R11
RGB PWM Driver: C2 IC2 R8 R10 R12

### Ports
INV_Pump_PWM, INV_Pump_Signal, LED_1_Return, LED_2_Return, LED_3_Return, LED_Digital, Light_12V, MTR_Pump_PWM, MTR_Pump_Signal, RGB_B_Return, RGB_Digital, RGB_G_Return, RGB_R_Return

### Nets
Board_GND: C1.1 C2.1 IC1.4(GND) IC2.4(GND) Q1.2(S) Q2.2(S) R5.2 R6.2
INV_Pump_PWM: R4.1 R6.1 ; port INV_Pump_PWM
INV_Pump_Signal: Q2.3(D) R2.2 ; port INV_Pump_Signal
LED_1_Return: R7.2 ; port LED_1_Return
LED_2_Return: IC1.2(OUTG) ; port LED_2_Return
LED_3_Return: IC1.3(OUTB) ; port LED_3_Return
LED_Digital: R11.1 ; port LED_Digital
Light_12V: R1.1 R2.1 R9.1 R10.1 ; port Light_12V
MTR_Pump_PWM: R3.1 R5.1 ; port MTR_Pump_PWM
MTR_Pump_Signal: Q1.3(D) R1.2 ; port MTR_Pump_Signal
RGB_B_Return: IC2.3(OUTB) ; port RGB_B_Return
RGB_Digital: R12.1 ; port RGB_Digital
RGB_G_Return: IC2.2(OUTG) ; port RGB_G_Return
RGB_R_Return: R8.2 ; port RGB_R_Return
NetC1_2: C1.2 IC1.8(VDD) R9.2
NetC2_2: C2.2 IC2.8(VDD) R10.2
NetIC1_1: IC1.1(OUTR) R7.1
NetIC1_6: IC1.6(DIN) R11.2
NetIC2_1: IC2.1(OUTR) R8.1
NetIC2_6: IC2.6(DIN) R12.2
NetQ1_1: Q1.1(G) R3.2
NetQ2_1: Q2.1(G) R4.2

Not connected (* = marked no-connect by the designer): IC1 5(DOUT) 7(SET); IC2 5(DOUT) 7(SET)

### Notes on the sheet
- (near Q1) ZXMN2F34FHTA
- (near Q2) ZXMN2F34FHTA
- Mosfet and PWM
- 6
- 10
- v.3.0
- Benjamin Liang

### Library data of the parts
C1 C2 = Cap Semi: as C8 on sheet Frequency_Analog; Published: 8-Jun-2000; LatestRevisionDate: 29-May-2009; LatestRevisionNote: IPC-7351 Footprint Added.; PackageReference: C1206; Publisher: Altium Limited; PackageDescription: Chip Capacitor
IC1 IC2 = ws2811s: Integrated Circuit; Manufacturer_Name: Worldsemi; Datasheet Link: https://cdn-shop.adafruit.com/datasheets/WS2811.pdf; Height: 1.75mm; Manufacturer_Part_Number: ws2811s
Q1 Q2 = CMP-2000-06249-1: Manufacturer: FairchildSemiconductor; RDS-on: 0.07@4.5VOhm; Typical Fall Time: 3ns; Maximum Drain Source Voltage: 20V; Rad Hard: No; Channel Mode: Enhancement; Package Version: Rev. 3, 05/2015; Maximum Gate Source Voltage: ±8V; Typical Rise Time: 8.5ns; Typical Turn-Off Delay Time: 11ns; Maximum Continuous Drain Current: 1.7A; Channel Type: N; Typical Turn-On Delay Time: 5ns; Packaging: Tape&Reel; Mounting Technology: SurfaceMount; Mounting: SurfaceMount; Manufacturer URL: https://www.fairchildsemi.com/; Datasheet URL: https://www.fairchildsemi.com/datasheets/FD/FDN335N.pdf; Package Description: 3-Pin Small Outline Transistor, Body 2.92 x 1.4 mm, Pitch 0.95 mm; Package URL: https://www.fairchildsemi.com/package-drawings/MA/MA03B.pdf; Datasheet Version: Rev. C, 04/1999; Package Reference: SSOT3L; Package: 3SuperSOT; Operating Temperature: -55to150°C; Category: MOSFET
R1 R2 R5 R6 = Res3: Resistor; Published: 8-Jun-2000; LatestRevisionDate: 29-May-2009; LatestRevisionNote: IPC-7351 Footprint Added.; PackageReference: J1-0603; Publisher: Altium Limited; PackageDescription: Chip Resistor; Value: 10K
R3 R4 R7-R12 = Res3: Resistor; Value: 10K; Published: 8-Jun-2000; LatestRevisionDate: 29-May-2009; LatestRevisionNote: IPC-7351 Footprint Added.; PackageReference: J1-0603; Publisher: Altium Limited; PackageDescription: Chip Resistor

## Sheet Power_Relay.SchDoc
size A4; SheetNumber: 8; SheetTotal: 11
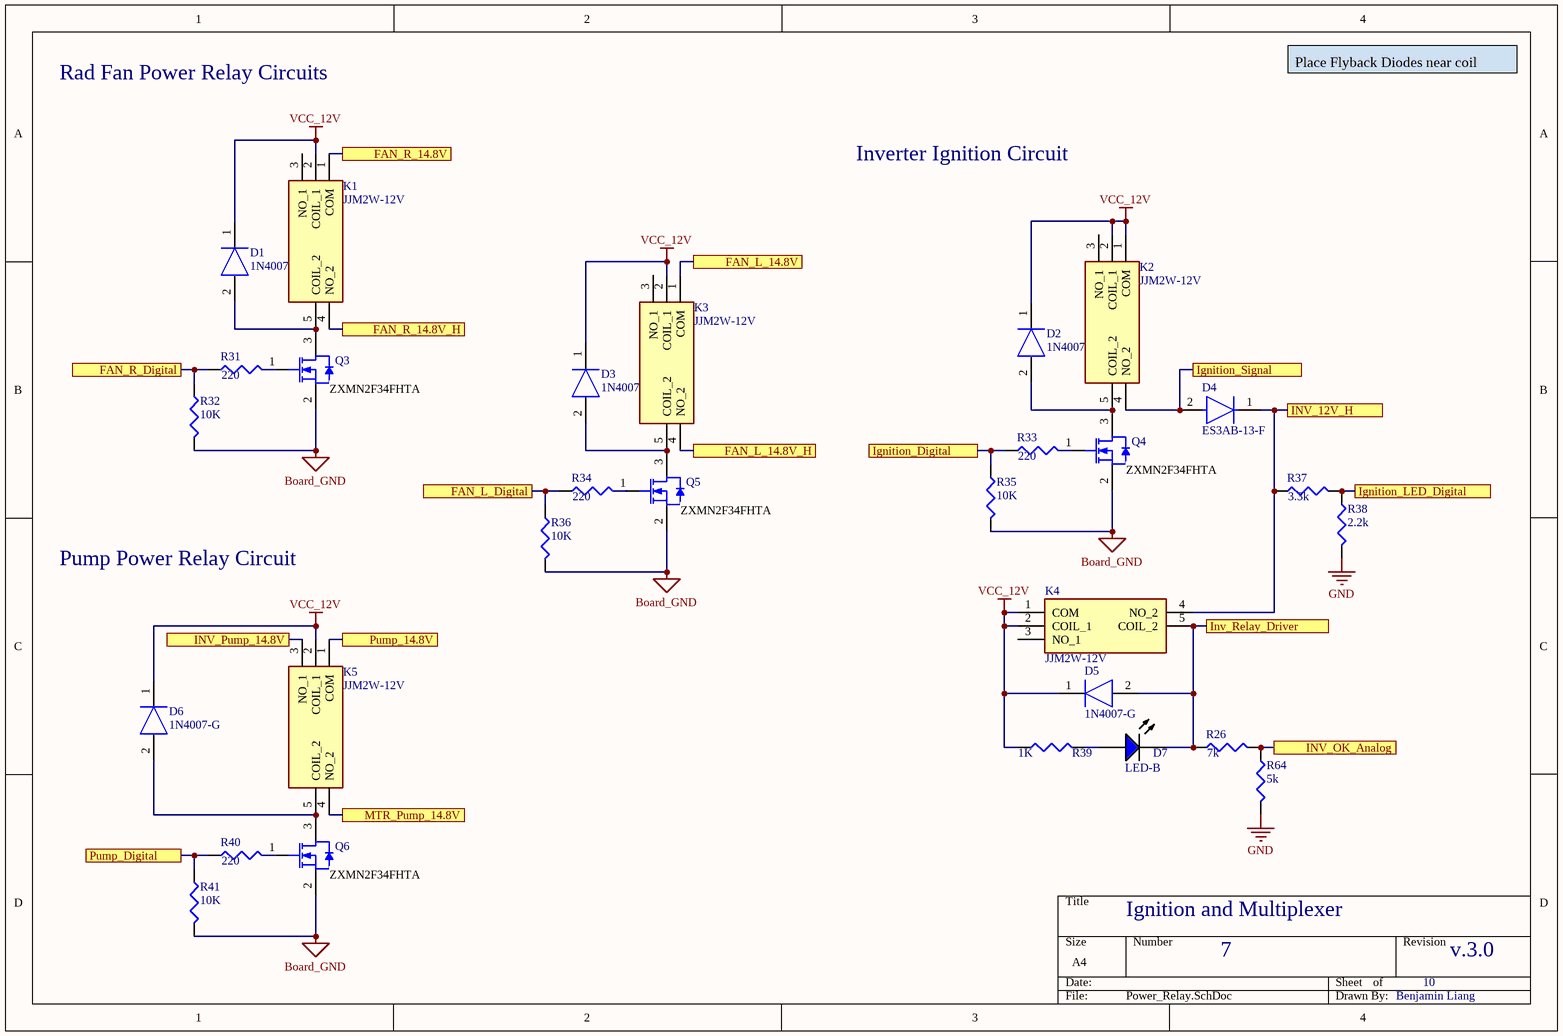
[diagram p7: Power_Relay.SchDoc]

### Parts
D1  1N4007-G  [DIOAD1410W90L470D235]
D2  1N4007-G  [DIOAD1410W90L470D235]
D3  1N4007-G  [DIOAD1410W90L470D235]
D4  ES3AB-13-F  [FP-SMB-MFG]
D5  1N4007-G  [DIOAD1410W90L470D235]
D6  1N4007-G  [DIOAD1410W90L470D235]
D7  LED-B  [LTST-C193TBKT_V]
K1  JJM2W-12V  [JJM2W12V]
K2  JJM2W-12V  [JJM2W12V]
K3  JJM2W-12V  [JJM2W12V]
K4  JJM2W-12V  [JJM2W12V]
K5  JJM2W-12V  [JJM2W12V]
Q3  ZXMN2F34FHTA  [FAIR-SSOT3L-3_V]  (value not drawn)
Q4  ZXMN2F34FHTA  [FAIR-SSOT3L-3_V]  (value not drawn)
Q5  ZXMN2F34FHTA  [FAIR-SSOT3L-3_V]  (value not drawn)
Q6  ZXMN2F34FHTA  [FAIR-SSOT3L-3_V]  (value not drawn)
R26  7k  [J1-0603]
R31  220  [J1-0603]
R32  10K  [J1-0603]
R33  220  [J1-0603]
R34  220  [J1-0603]
R35  10K  [J1-0603]
R36  10K  [J1-0603]
R37  3.3k  [J1-0603]
R38  2.2k  [J1-0603]
R39  1K  [J1-0603]
R40  220  [J1-0603]
R41  10K  [J1-0603]
R64  5k  [J1-0603]

### Ports
FAN_L_14.8V, FAN_L_14.8V_H, FAN_L_Digital, FAN_R_14.8V, FAN_R_14.8V_H, FAN_R_Digital, Ignition_Digital, Ignition_LED_Digital, Ignition_Signal, INV_12V_H, INV_OK_Analog, INV_Pump_14.8V, Inv_Relay_Driver, MTR_Pump_14.8V, Pump_14.8V, Pump_Digital

### Nets
Board_GND: Q3.2(S) Q4.2(S) Q5.2(S) Q6.2(S) R32.2 R35.2 R36.2 R41.2
GND: R38.2 R64.2
VCC_12V: D1.1(K) D2.1(K) D3.1(K) D5.1(K) D6.1(K) K1.2(COIL_1) K2.1(COM) K2.2(COIL_1) K3.2(COIL_1) K4.1(COM) K4.2(COIL_1) K5.2(COIL_1) R39.1
FAN_L_14.8V: K3.1(COM) ; port FAN_L_14.8V
FAN_L_14.8V_H: K3.4(NO_2) ; port FAN_L_14.8V_H
FAN_L_Digital: R34.1 R36.1 ; port FAN_L_Digital
FAN_R_14.8V: K1.1(COM) ; port FAN_R_14.8V
FAN_R_14.8V_H: K1.4(NO_2) ; port FAN_R_14.8V_H
FAN_R_Digital: R31.1 R32.1 ; port FAN_R_Digital
Ignition_Digital: R33.1 R35.1 ; port Ignition_Digital
Ignition_LED_Digital: R37.2 R38.1 ; port Ignition_LED_Digital
Ignition_Signal: D4.2(A) K2.4(NO_2) ; port Ignition_Signal
INV_12V_H: D4.1(C) K4.4(NO_2) R37.1 ; port INV_12V_H
INV_OK_Analog: R26.2 R64.1 ; port INV_OK_Analog
INV_Pump_14.8V: K5.3(NO_1) ; port INV_Pump_14.8V
Inv_Relay_Driver: D5.2(A) D7.2(K) K4.5(COIL_2) R26.1 ; port Inv_Relay_Driver
MTR_Pump_14.8V: K5.4(NO_2) ; port MTR_Pump_14.8V
Pump_14.8V: K5.1(COM) ; port Pump_14.8V
Pump_Digital: R40.1 R41.1 ; port Pump_Digital
NetD1_2: D1.2(A) K1.5(COIL_2) Q3.3(D)
NetD2_2: D2.2(A) K2.5(COIL_2) Q4.3(D)
NetD3_2: D3.2(A) K3.5(COIL_2) Q5.3(D)
NetD6_2: D6.2(A) K5.5(COIL_2) Q6.3(D)
NetD7_1: D7.1(A) R39.2
NetQ3_1: Q3.1(G) R31.2
NetQ4_1: Q4.1(G) R33.2
NetQ5_1: Q5.1(G) R34.2
NetQ6_1: Q6.1(G) R40.2

Not connected (* = marked no-connect by the designer): K1 3(NO_1); K2 3(NO_1); K3 3(NO_1); K4 3(NO_1)

### Notes on the sheet
- Rad Fan Power Relay Circuits
- Place Flyback Diodes near coil
- Inverter Ignition Circuit
- (near Q3) ZXMN2F34FHTA
- (near Q5) ZXMN2F34FHTA
- (near Q4) ZXMN2F34FHTA
- Pump Power Relay Circuit
- (near Q6) ZXMN2F34FHTA
- Ignition and Multiplexer
- 7
- 10
- v.3.0
- Benjamin Liang

### Library data of the parts
D1-D3 D5 D6 = 1N4007-G: Diode; Manufacturer_Name: Comchip Technology; Datasheet Link: https://datasheet.datasheetarchive.com/originals/distributors/Datasheets-DGA23/1390217.pdf; Manufacturer_Part_Number: 1N4007-G; Mouser Part Number: 750-1N4007-G; Mouser Price/Stock: https://www.mouser.co.uk/ProductDetail/Comchip-Technology/1N4007-G?qs=2qJf6qQ4IOKzApuByvlhjQ%3D%3D; Arrow Part Number: 1N4007-G; Arrow Price/Stock: https://www.arrow.com/en/products/1n4007-g/comchip-technology?region=nac
D4 = CMP-12791-000010-1: DIODE GEN PURP 50V 3A SMB; Manufacturer: Diodes; Capacitance: 45pF; Standoff Height: 0.05mm; Max Surge Forward Current: 100A; Peak Reverse Current: 10uA; Max Junction Temp: +150°C; Value: 45pF; Reverse Voltage: 50V; Device Class L3: Rectifier Diodes; Max Repetitive Reverse Voltage: 50V; Footprint Url: https://www.diodes.com/assets/Package-Files/SMB.pdf; Mouser Description: Rectifiers 50V 3A; RoHS: TRUE; Device Class L2: Diodes; Forward Current: 3A; ComponentLink2Description: Datasheet; Package: SMB; Temperature Range High: +150°C; Manufacturer Part Number: ES3AB-13-F; Temperature: -55°C to +150°C; Device Class L1: Discrete Semiconductors; Octopart: https://octopart.com/es3ab-13-f-diodes+inc.-328916; Temperature Range Low: -55°C; Height: 2.5mm; Automotive: No; ComponentLink2URL: https://forum.upverter.com/uploads/short-url/2fx1zdCm0X7KnJF0hsWL21N8TrX.pdf; Lead Free: Yes; Category: Diode; Digikey Description: DIODE GEN PURP 50V 3A SMB
D7 = CMP-2000-06624-1: LED Uni-Color Blue, 76 mW, 20 mA, -20 to 80 degC, 2-Pin SMD, RoHS, Tape and Reel / LTST-C193TBKT-5A; Viewing Angle: 130deg; Wavelength/Color Temperature: 465nmto475nm; Brand: Lite-On; Forward Voltage: 2.8V; LED Size: 1.6mmx0.8mmx0.35mm; Luminous Intensity: 15mcd; Forward Current: 5mA; Package / Case: 0603; Mounting Technology: SurfaceMount; Datasheet URL: https://datasheet.ciiva.com/15201/getdatasheetpartid-293056-15201395.pdf; Illumination Color: Blue; Maximum Operating Temperature: +80C; Datasheet Version: 08/2011; Package Description: 2-Pin Surface Mount Device, Body 0.8 x 1.6 mm; Manufacturer: Lite-On; Factory Pack Quantity: 3000; RoHS: Details; Minimum Operating Temperature: -20C; Packaging: Reel; Manufacturer URL: http://www.us.liteon.com/; Product Category: StandardLEDs-SMD; Package Reference: C193TBKT
K1-K5 = JJM2W-12V: Relay or Contactor; Manufacturer_Name: Panasonic; Datasheet Link: https://componentsearchengine.com/Datasheets/1/JJM2w-12V.pdf; Height: 14mm; Manufacturer_Part_Number: JJM2W-12V; Mouser Part Number: 769-JJM2W-12V; Mouser Price/Stock: https://www.mouser.com/Search/Refine.aspx?Keyword=769-JJM2W-12V; Arrow Part Number: JJM2W-12V; Arrow Price/Stock: https://www.arrow.com/en/products/jjm2w-12v/panasonic
Q3-Q6 = CMP-2000-06249-1: as Q1 on sheet PWM_Pump_Led; Packaging: Tape&Reel; Mounting Technology: SurfaceMount; Mounting: SurfaceMount; Manufacturer URL: https://www.fairchildsemi.com/; Datasheet URL: https://www.fairchildsemi.com/datasheets/FD/FDN335N.pdf; Package Description: 3-Pin Small Outline Transistor, Body 2.92 x 1.4 mm, Pitch 0.95 mm; Package URL: https://www.fairchildsemi.com/package-drawings/MA/MA03B.pdf; Datasheet Version: Rev. C, 04/1999; Package Reference: SSOT3L; Package: 3SuperSOT; Operating Temperature: -55to150°C; Category: MOSFET
R26 R31 R33 R34 R37-R40 R64 = Res3: Resistor; Value: 10K; Published: 8-Jun-2000; LatestRevisionDate: 29-May-2009; LatestRevisionNote: IPC-7351 Footprint Added.; PackageReference: J1-0603; Publisher: Altium Limited; PackageDescription: Chip Resistor
R32 R35 R36 R41 = Res3: Resistor; Published: 8-Jun-2000; LatestRevisionDate: 29-May-2009; LatestRevisionNote: IPC-7351 Footprint Added.; PackageReference: J1-0603; Publisher: Altium Limited; PackageDescription: Chip Resistor; Value: 10K

## Sheet Shutdown_Circuit.SchDoc
size A4; SheetNumber: 9; SheetTotal: 11
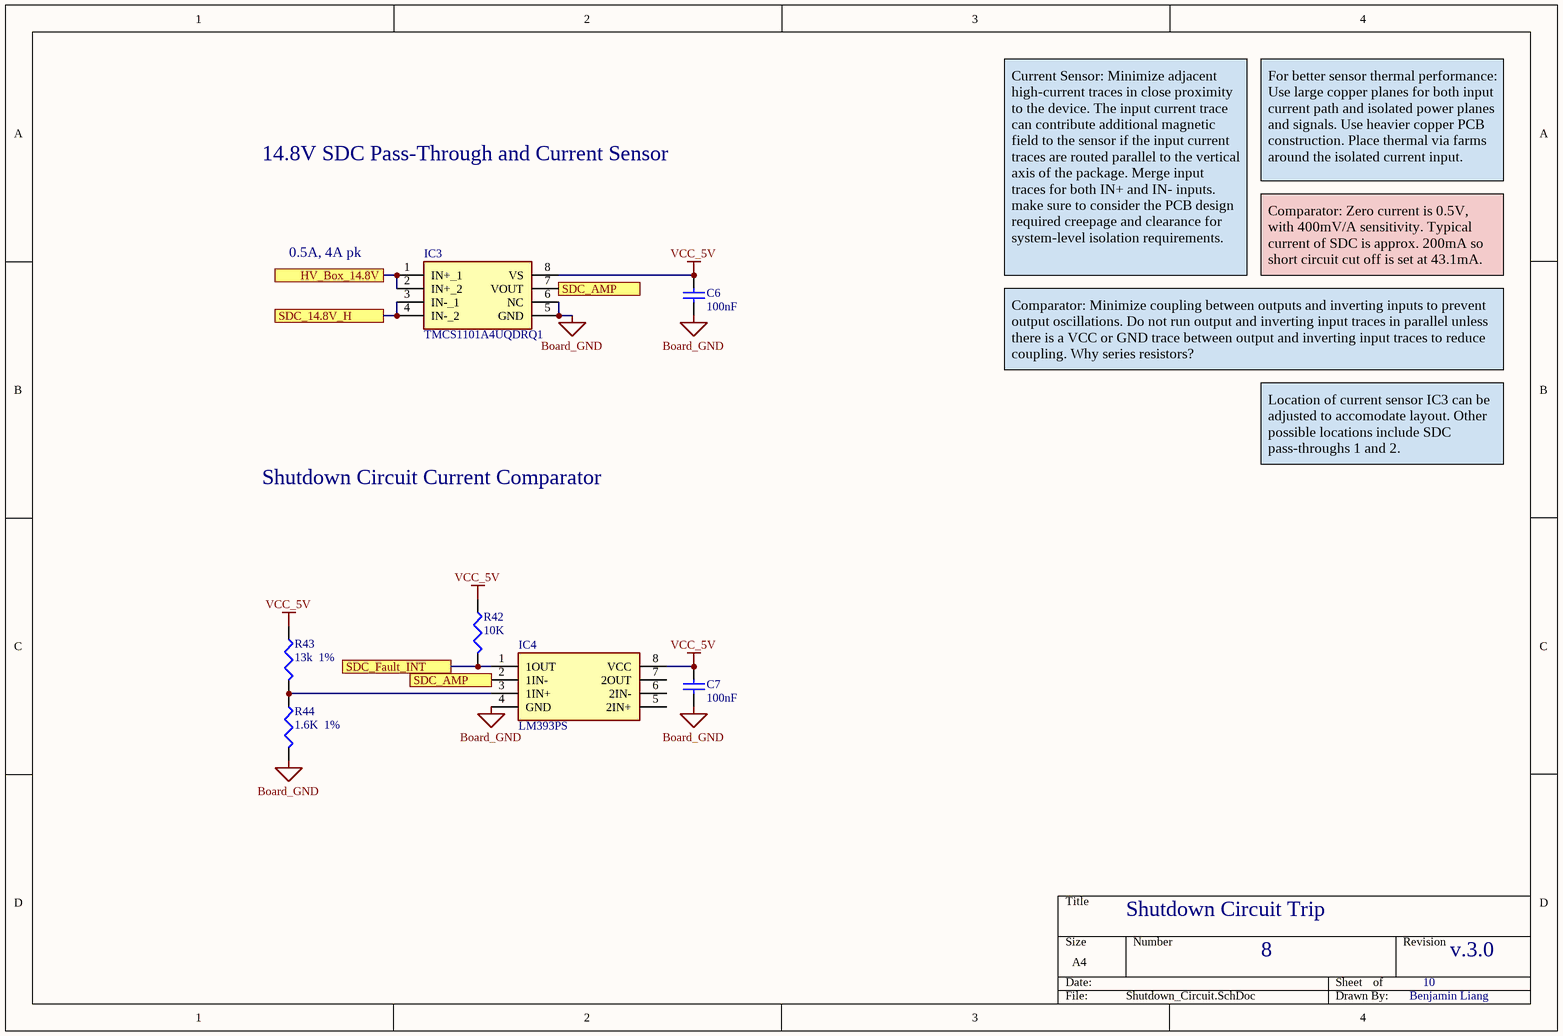
[diagram p8: Shutdown_Circuit.SchDoc]

### Parts
C6  100nF  [C1206]
C7  100nF  [C1206]
IC3  TMCS1101A4UQDRQ1  [SOIC127P600X175-8N]
IC4  LM393PS  [SOIC127P780X200-8N]
R42  10K  [J1-0603]
R43  13k  1%  [J1-0603]
R44  1.6K  1%  [J1-0603]

### Ports
HV_Box_14.8V, SDC_14.8V_H, SDC_AMP, SDC_Fault_INT

### Nets
Board_GND: C6.2 C7.2 IC3.5(GND) IC3.6(NC) IC4.4(GND) R44.2
VCC_5V: C6.1 C7.1 IC3.8(VS) IC4.8(VCC) R42.1 R43.1
HV_Box_14.8V: IC3.1(IN+_1) IC3.2(IN+_2) ; port HV_Box_14.8V
SDC_14.8V_H: IC3.3(IN-_1) IC3.4(IN-_2) ; port SDC_14.8V_H
SDC_AMP: IC3.7(VOUT) IC4.2(1IN-) ; port SDC_AMP
SDC_Fault_INT: IC4.1(1OUT) R42.2 ; port SDC_Fault_INT
NetIC4_3: IC4.3(1IN+) R43.2 R44.1

Not connected (* = marked no-connect by the designer): IC4 5(2IN+) 6(2IN-) 7(2OUT)

### Notes on the sheet
- 14.8V SDC Pass-Through and Current Sensor
- For better sensor thermal performance:        Use large copper planes for both input current path and isolated power planes and signals. Use heavier copper PCB construction. Place thermal via farms around the isolated current input.
- 0.5A, 4A pk
- Current Sensor: Minimize adjacent high-current traces in close proximity to the device. The input current trace can contribute additional magnetic field to the sensor if the input current traces are routed parallel to the vertical axis of the package. Merge input traces for both IN+ and IN- inputs. make sure to consider the PCB design required creepage and clearance for system-level isolation requirements.
- Comparator: Zero current is 0.5V, with 400mV/A sensitivity. Typical current of SDC is approx. 200mA so short circuit cut off is set at 43.1mA.
- Comparator: Minimize coupling between outputs and inverting inputs to prevent output oscillations. Do not run output and inverting input traces in parallel unless there is a VCC or GND trace between output and inverting input traces to reduce coupling. Why series resistors?
- Shutdown Circuit Current Comparator
- Location of current sensor IC3 can be adjusted to accomodate layout. Other possible locations include SDC pass-throughs 1 and 2.
- Shutdown Circuit Trip
- 8
- 10
- v.3.0
- Benjamin Liang

### Library data of the parts
C6 C7 = Cap Semi: Capacitor (Semiconductor SIM Model); Published: 8-Jun-2000; LatestRevisionDate: 29-May-2009; LatestRevisionNote: IPC-7351 Footprint Added.; PackageReference: C1206; Publisher: Altium Limited; PackageDescription: Chip Capacitor; Value: 100nF
IC3 = TMCS1101A4UQDRQ1: Integrated Circuit; Manufacturer_Name: Texas Instruments; Datasheet Link: https://www.ti.com/lit/ds/symlink/tmcs1101-q1.pdf?HQS=dis-dk-null-digikeymode-dsf-pf-null-wwe&ts=1639364451794; Height: 1.75mm; Manufacturer_Part_Number: TMCS1101A4UQDRQ1; Mouser Part Number: 595-TMCS1101A4UQDRQ1; Mouser Price/Stock: https://www.mouser.co.uk/ProductDetail/Texas-Instruments/TMCS1101A4UQDRQ1?qs=QNEnbhJQKvYtWCVWgIciDg%3D%3D; Arrow Part Number: TMCS1101A4UQDRQ1; Arrow Price/Stock: https://www.arrow.com/en/products/tmcs1101a4uqdrq1/texas-instruments?region=nac
IC4 = LM393PS: Integrated Circuit; Manufacturer_Name: Texas Instruments; Datasheet Link: https://www.ti.com/lit/gpn/LM393; Height: 2mm; Manufacturer_Part_Number: LM393PS; Arrow Part Number: LM393PS; Arrow Price/Stock: https://www.arrow.com/en/products/lm393ps/texas-instruments
R42-R44 = Res3: Resistor; Value: 220; Published: 8-Jun-2000; LatestRevisionDate: 29-May-2009; LatestRevisionNote: IPC-7351 Footprint Added.; PackageReference: J1-0603; Publisher: Altium Limited; PackageDescription: Chip Resistor

## Sheet Power_Distribution.SchDoc
size A4; SheetNumber: 10; SheetTotal: 11
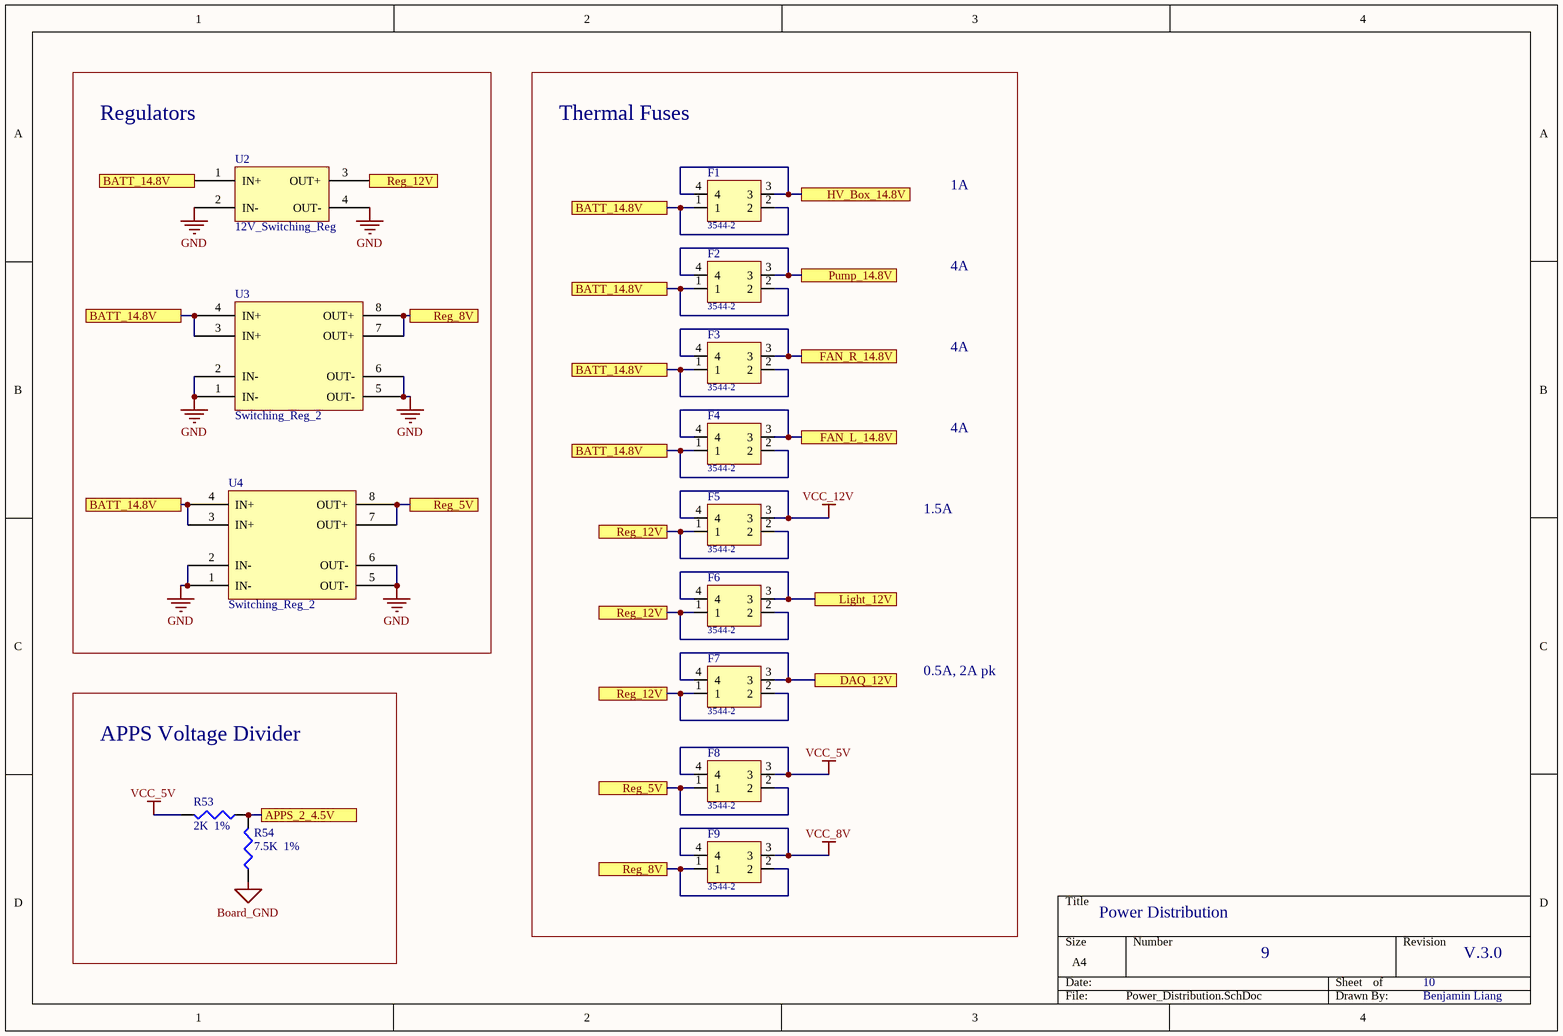
[diagram p9: Power_Distribution.SchDoc]

### Parts
F1  3544-2  [3544-2]
F2  3544-2  [3544-2]
F3  3544-2  [3544-2]
F4  3544-2  [3544-2]
F5  3544-2  [3544-2]
F6  3544-2  [3544-2]
F7  3544-2  [3544-2]
F8  3544-2  [3544-2]
F9  3544-2  [3544-2]
R53  2K  1%  [J1-0603]
R54  7.5K  1%  [J1-0603]
U2  12V_Switching_Reg  [PCBComponent_1 - duplicate]
U3  Switching_Reg_2  [PCBComponent_1]
U4  Switching_Reg_2  [PCBComponent_1]

### Blocks framed on the sheet
Regulators: U2-U4
Thermal Fuses: F1-F9
APPS Voltage Divider: R53 R54

### Ports
APPS_2_4.5V, BATT_14.8V, DAQ_12V, FAN_L_14.8V, FAN_R_14.8V, HV_Box_14.8V, Light_12V, Pump_14.8V, Reg_5V, Reg_8V, Reg_12V

### Nets
Board_GND: R54.1
GND: U2.2(IN-) U2.4(OUT-) U3.1(IN-) U3.2(IN-) U3.5(OUT-) U3.6(OUT-) U4.1(IN-) U4.2(IN-) U4.5(OUT-) U4.6(OUT-)
VCC_5V: F8.3 F8.4 R53.2
VCC_8V: F9.3 F9.4
VCC_12V: F5.3 F5.4
APPS_2_4.5V: R53.1 R54.2 ; port APPS_2_4.5V
BATT_14.8V: F1.1 F1.2 F2.1 F2.2 F3.1 F3.2 F4.1 F4.2 U2.1(IN+) U3.3(IN+) U3.4(IN+) U4.3(IN+) U4.4(IN+) ; port BATT_14.8V
DAQ_12V: F7.3 F7.4 ; port DAQ_12V
FAN_L_14.8V: F4.3 F4.4 ; port FAN_L_14.8V
FAN_R_14.8V: F3.3 F3.4 ; port FAN_R_14.8V
HV_Box_14.8V: F1.3 F1.4 ; port HV_Box_14.8V
Light_12V: F6.3 F6.4 ; port Light_12V
Pump_14.8V: F2.3 F2.4 ; port Pump_14.8V
Reg_5V: F8.1 F8.2 U4.7(OUT+) U4.8(OUT+) ; port Reg_5V
Reg_8V: F9.1 F9.2 U3.7(OUT+) U3.8(OUT+) ; port Reg_8V
Reg_12V: F5.1 F5.2 F6.1 F6.2 F7.1 F7.2 U2.3(OUT+) ; port Reg_12V

### Notes on the sheet
- 1A
- 4A
- 1.5A
- 0.5A, 2A pk
- Power Distribution
- 9
- 10
- V.3.0
- Benjamin Liang

### Library data of the parts
F1-F9 = Component_1
R53 R54 = Res3: Resistor; Value: 220; Published: 8-Jun-2000; LatestRevisionDate: 29-May-2009; LatestRevisionNote: IPC-7351 Footprint Added.; PackageReference: J1-0603; Publisher: Altium Limited; PackageDescription: Chip Resistor
U2 = Switching_Reg

## Sheet BMS.SchDoc
size A4; SheetNumber: 11; SheetTotal: 11
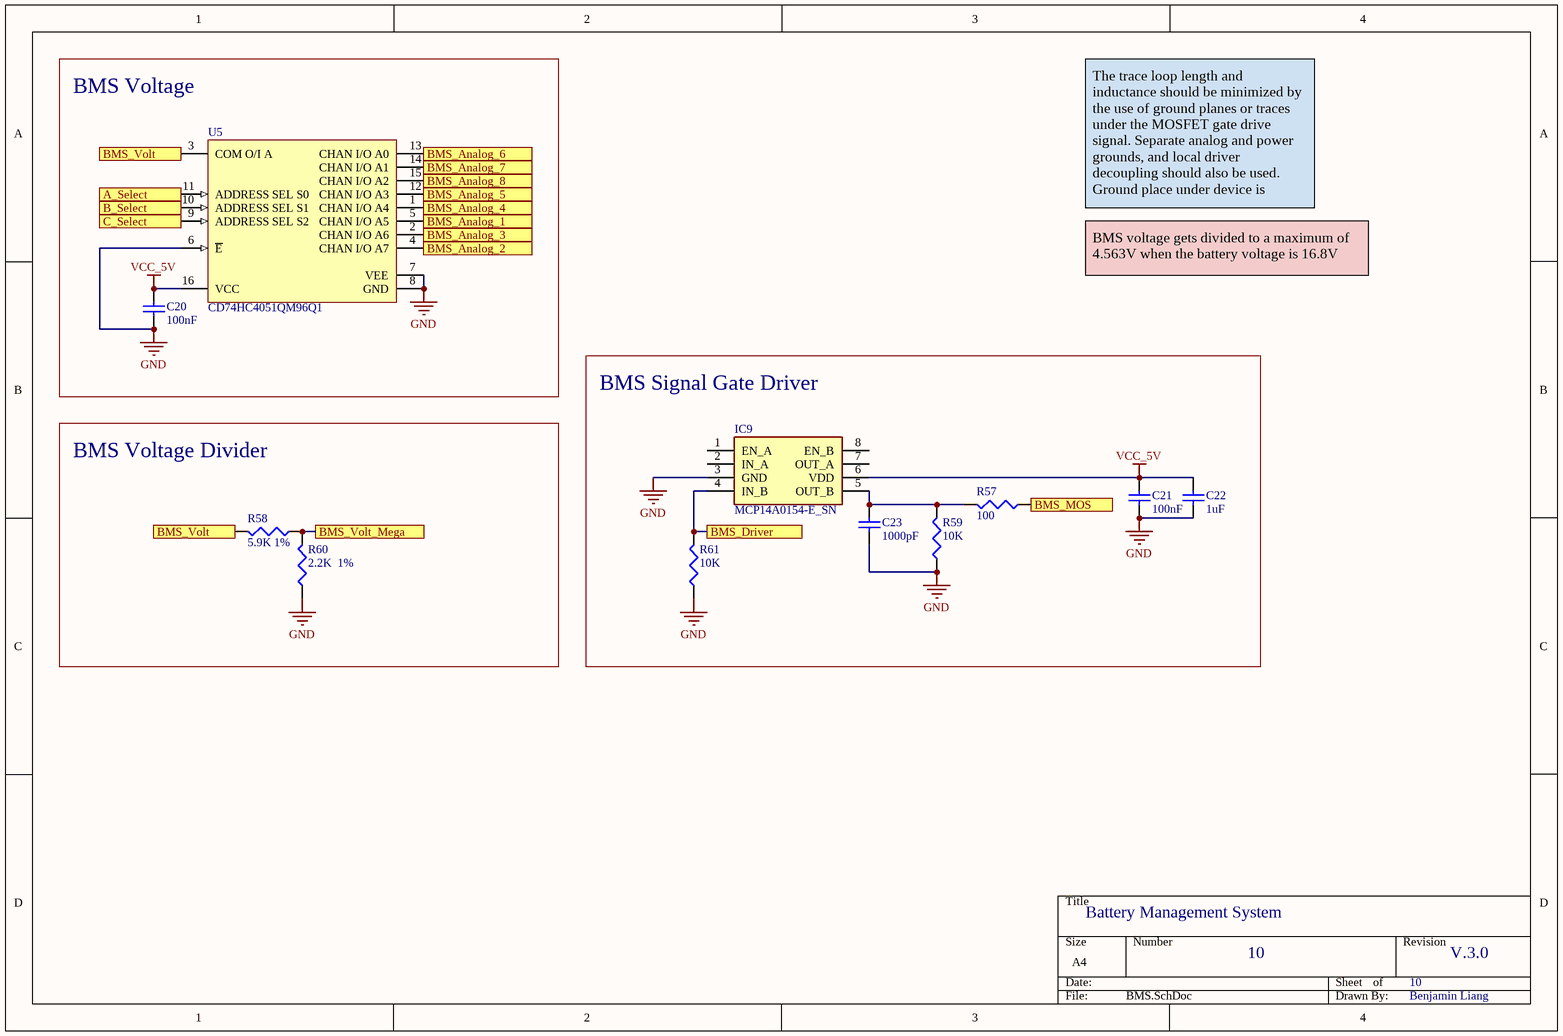
[diagram p10: BMS.SchDoc]

### Parts
C20  100nF  [C1206]
C21  100nF  [C1206]
C22  1uF  [C1206]
C23  1000pF  [C1206]
IC9  MCP14A0154-E_SN  [SOIC127P599X173-8N]
R57  100  [J1-0603]
R58  5.9K 1%  [J1-0603]
R59  10K  [J1-0603]
R60  2.2K  1%  [J1-0603]
R61  10K  [J1-0603]
U5  CD74HC4051QM96Q1  [D0016A_L]

### Blocks framed on the sheet
BMS Voltage: C20 U5
BMS Signal Gate Driver: C21-C23 IC9 R57 R59 R61
BMS Voltage Divider: R58 R60

### Ports
A_Select, B_Select, BMS_Analog_1, BMS_Analog_2, BMS_Analog_3, BMS_Analog_4, BMS_Analog_5, BMS_Analog_6, BMS_Analog_7, BMS_Analog_8, BMS_Driver, BMS_MOS, BMS_Volt, BMS_Volt_Mega, C_Select

### Nets
GND: C20.2 C21.2 C22.2 C23.2 IC9.3(GND) R59.1 R60.1 R61.1 U5.6(~{E}) U5.7(VEE) U5.8(GND)
VCC_5V: C20.1 C21.1 C22.1 IC9.6(VDD) U5.16(VCC)
A_Select: U5.11(ADDRESS_SEL_S0) ; port A_Select
B_Select: U5.10(ADDRESS_SEL_S1) ; port B_Select
BMS_Analog_1: U5.5(CHAN_I/O_A5) ; port BMS_Analog_1
BMS_Analog_2: U5.4(CHAN_I/O_A7) ; port BMS_Analog_2
BMS_Analog_3: U5.2(CHAN_I/O_A6) ; port BMS_Analog_3
BMS_Analog_4: U5.1(CHAN_I/O_A4) ; port BMS_Analog_4
BMS_Analog_5: U5.12(CHAN_I/O_A3) ; port BMS_Analog_5
BMS_Analog_6: U5.13(CHAN_I/O_A0) ; port BMS_Analog_6
BMS_Analog_7: U5.14(CHAN_I/O_A1) ; port BMS_Analog_7
BMS_Analog_8: U5.15(CHAN_I/O_A2) ; port BMS_Analog_8
BMS_Driver: IC9.4(IN_B) R61.2 ; port BMS_Driver
BMS_MOS: R57.1 ; port BMS_MOS
BMS_Volt: R58.2 U5.3(COM_O/I_A) ; port BMS_Volt
BMS_Volt_Mega: R58.1 R60.2 ; port BMS_Volt_Mega
C_Select: U5.9(ADDRESS_SEL_S2) ; port C_Select
NetC23_1: C23.1 IC9.5(OUT_B) R57.2 R59.2

Not connected (* = marked no-connect by the designer): IC9 1(EN_A) 2(IN_A) 7(OUT_A) 8(EN_B)

### Notes on the sheet
- The trace loop length and inductance should be minimized by
  the use of ground planes or traces under the MOSFET gate drive signal. Separate analog and power grounds, and local driver decoupling should also be used. Ground place under device is recommended.
- BMS voltage gets divided to a maximum of 4.563V when the battery voltage is 16.8V
- Battery Management System
- 10
- V.3.0
- Benjamin Liang

### Library data of the parts
C20 C21 = Cap Semi: Capacitor (Semiconductor SIM Model); Published: 8-Jun-2000; LatestRevisionDate: 29-May-2009; LatestRevisionNote: IPC-7351 Footprint Added.; PackageReference: C1206; Publisher: Altium Limited; PackageDescription: Chip Capacitor; Value: 100nF
C22 C23 = Cap Semi: as C8 on sheet Frequency_Analog; Published: 8-Jun-2000; LatestRevisionDate: 29-May-2009; LatestRevisionNote: IPC-7351 Footprint Added.; PackageReference: C1206; Publisher: Altium Limited; PackageDescription: Chip Capacitor
IC9 = MCP14A0154-E_SN: Integrated Circuit; Manufacturer_Name: Microchip; Manufacturer_Part_Number: MCP14A0154-E/SN; Datasheet Link: http://www.microchip.com/mymicrochip/filehandler.aspx?ddocname=en584525; Height: 1.1mm; Mouser Part Number: 579-MCP14A0154-E/SN; Mouser Price/Stock: https://www.mouser.co.uk/ProductDetail/Microchip-Technology/MCP14A0154-E-SN?qs=BA62vJVifGqWAZTNBysjlw%3D%3D; Arrow Part Number: MCP14A0154-E/SN; Arrow Price/Stock: https://www.arrow.com/en/products/mcp14a0154-esn/microchip-technology?region=nac
R57 R59 = Res3: Resistor; Value: 47K; Published: 8-Jun-2000; LatestRevisionDate: 29-May-2009; LatestRevisionNote: IPC-7351 Footprint Added.; PackageReference: J1-0603; Publisher: Altium Limited; PackageDescription: Chip Resistor
R58 R60 = Res3: Resistor; Value: 220; Published: 8-Jun-2000; LatestRevisionDate: 29-May-2009; LatestRevisionNote: IPC-7351 Footprint Added.; PackageReference: J1-0603; Publisher: Altium Limited; PackageDescription: Chip Resistor
R61 = Res3: Resistor; Value: 4.7K; Published: 8-Jun-2000; LatestRevisionDate: 29-May-2009; LatestRevisionNote: IPC-7351 Footprint Added.; PackageReference: J1-0603; Publisher: Altium Limited; PackageDescription: Chip Resistor
U5 = CMP-1575-00013-4: Automotive Catalog High Speed CMOS Logic Analog Multiplexers/Demultiplexers, D0016A, LARGE T&R; Generic Part Number: CD74HC4051-Q1; Manufacturer: Texas Instruments; Configuration: 1 X 1：8 MUX; Bandwidth(Max)(MHz): 180; Crosstalk: Yes; VCC(Max)(V): 6; Ron(Max)(Ohms): 130; VCC(Min)(V): 2; Ron(Typ)(Ohms): 45; PackageReference: D0016A; Output Type: CMOS; Code_JEDEC: MS-012 variation AC; Operating Temperature Range(C): -40 to 125; DatasheetVersion: SCLS552A; PackageVersion: http://www.ti.com/lit/ml/mpds178g/mpds178g.pdf; Rating: Automotive